# EAGLE schematic LAUNCHXL2_570LC43_RM57L (EAGLE 7.3.0), part 1 of 2
DATABASE: ./BOM/LAUNCHXL2_570LC43_RM57L_PARTDB.csv; DOC_NUMBER: LAUNCHXL2-570LC43 / LAUNCHXL2-RM57L; REV: A1

## Sheet 1 of 17
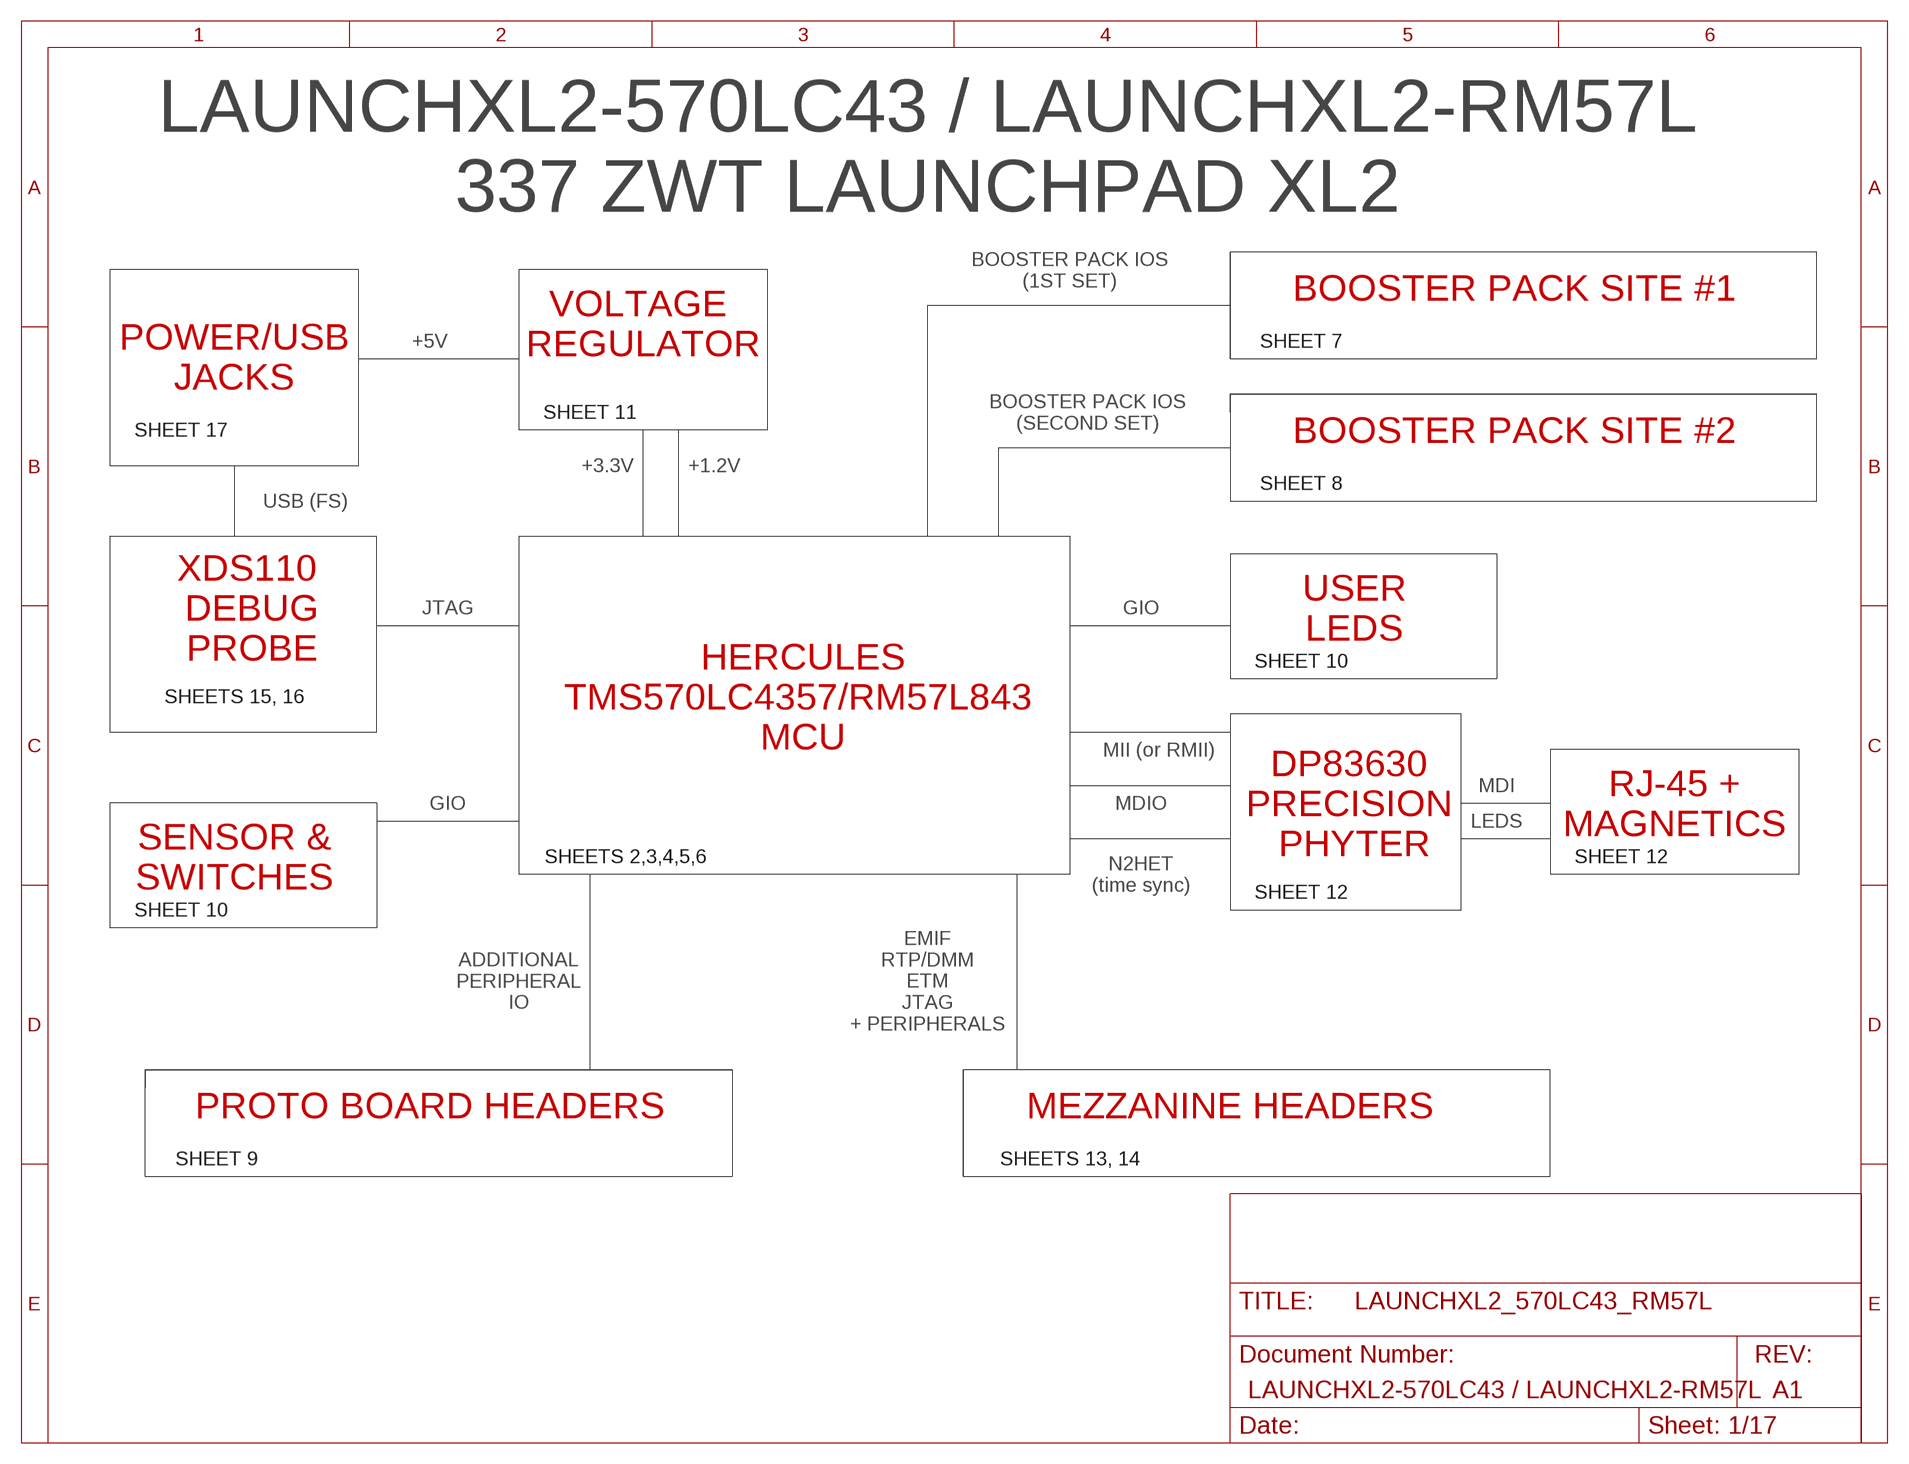
[diagram p0: schematic, sheet 1]

### Notes on the sheet
- LAUNCHXL2-570LC43 / LAUNCHXL2-RM57L
  337 ZWT LAUNCHPAD XL2
- BOOSTER PACK IOS
  (1ST SET)
- BOOSTER PACK SITE #1
- VOLTAGE 
  REGULATOR
- +5V | SHEET 7
- POWER/USB
  JACKS
- SHEET 11
- BOOSTER PACK IOS
  (SECOND SET)
- SHEET 17 | BOOSTER PACK SITE #2
- +3.3V | +1.2V
- SHEET 8
- USB (FS)
- XDS110 
  DEBUG
  PROBE
- JTAG | GIO
- USER
  LEDS
- SHEET 10
- SHEETS 15, 16
- HERCULES
  TMS570LC4357/RM57L843 
  MCU
- MII (or RMII)
- MDI
- GIO | MDIO
- DP83630 
  PRECISION 
  PHYTER
- RJ-45 +
  MAGNETICS
- LEDS
- SENSOR &
  SWITCHES
- SHEETS 2,3,4,5,6 | SHEET 12
- N2HET
  (time sync)
- SHEET 12
- SHEET 10
- ADDITIONAL
  PERIPHERAL
  IO
- EMIF
  RTP/DMM
  ETM
  JTAG
  + PERIPHERALS
- PROTO BOARD HEADERS | MEZZANINE HEADERS
- SHEET 9 | SHEETS 13, 14

## Sheet 2 of 17
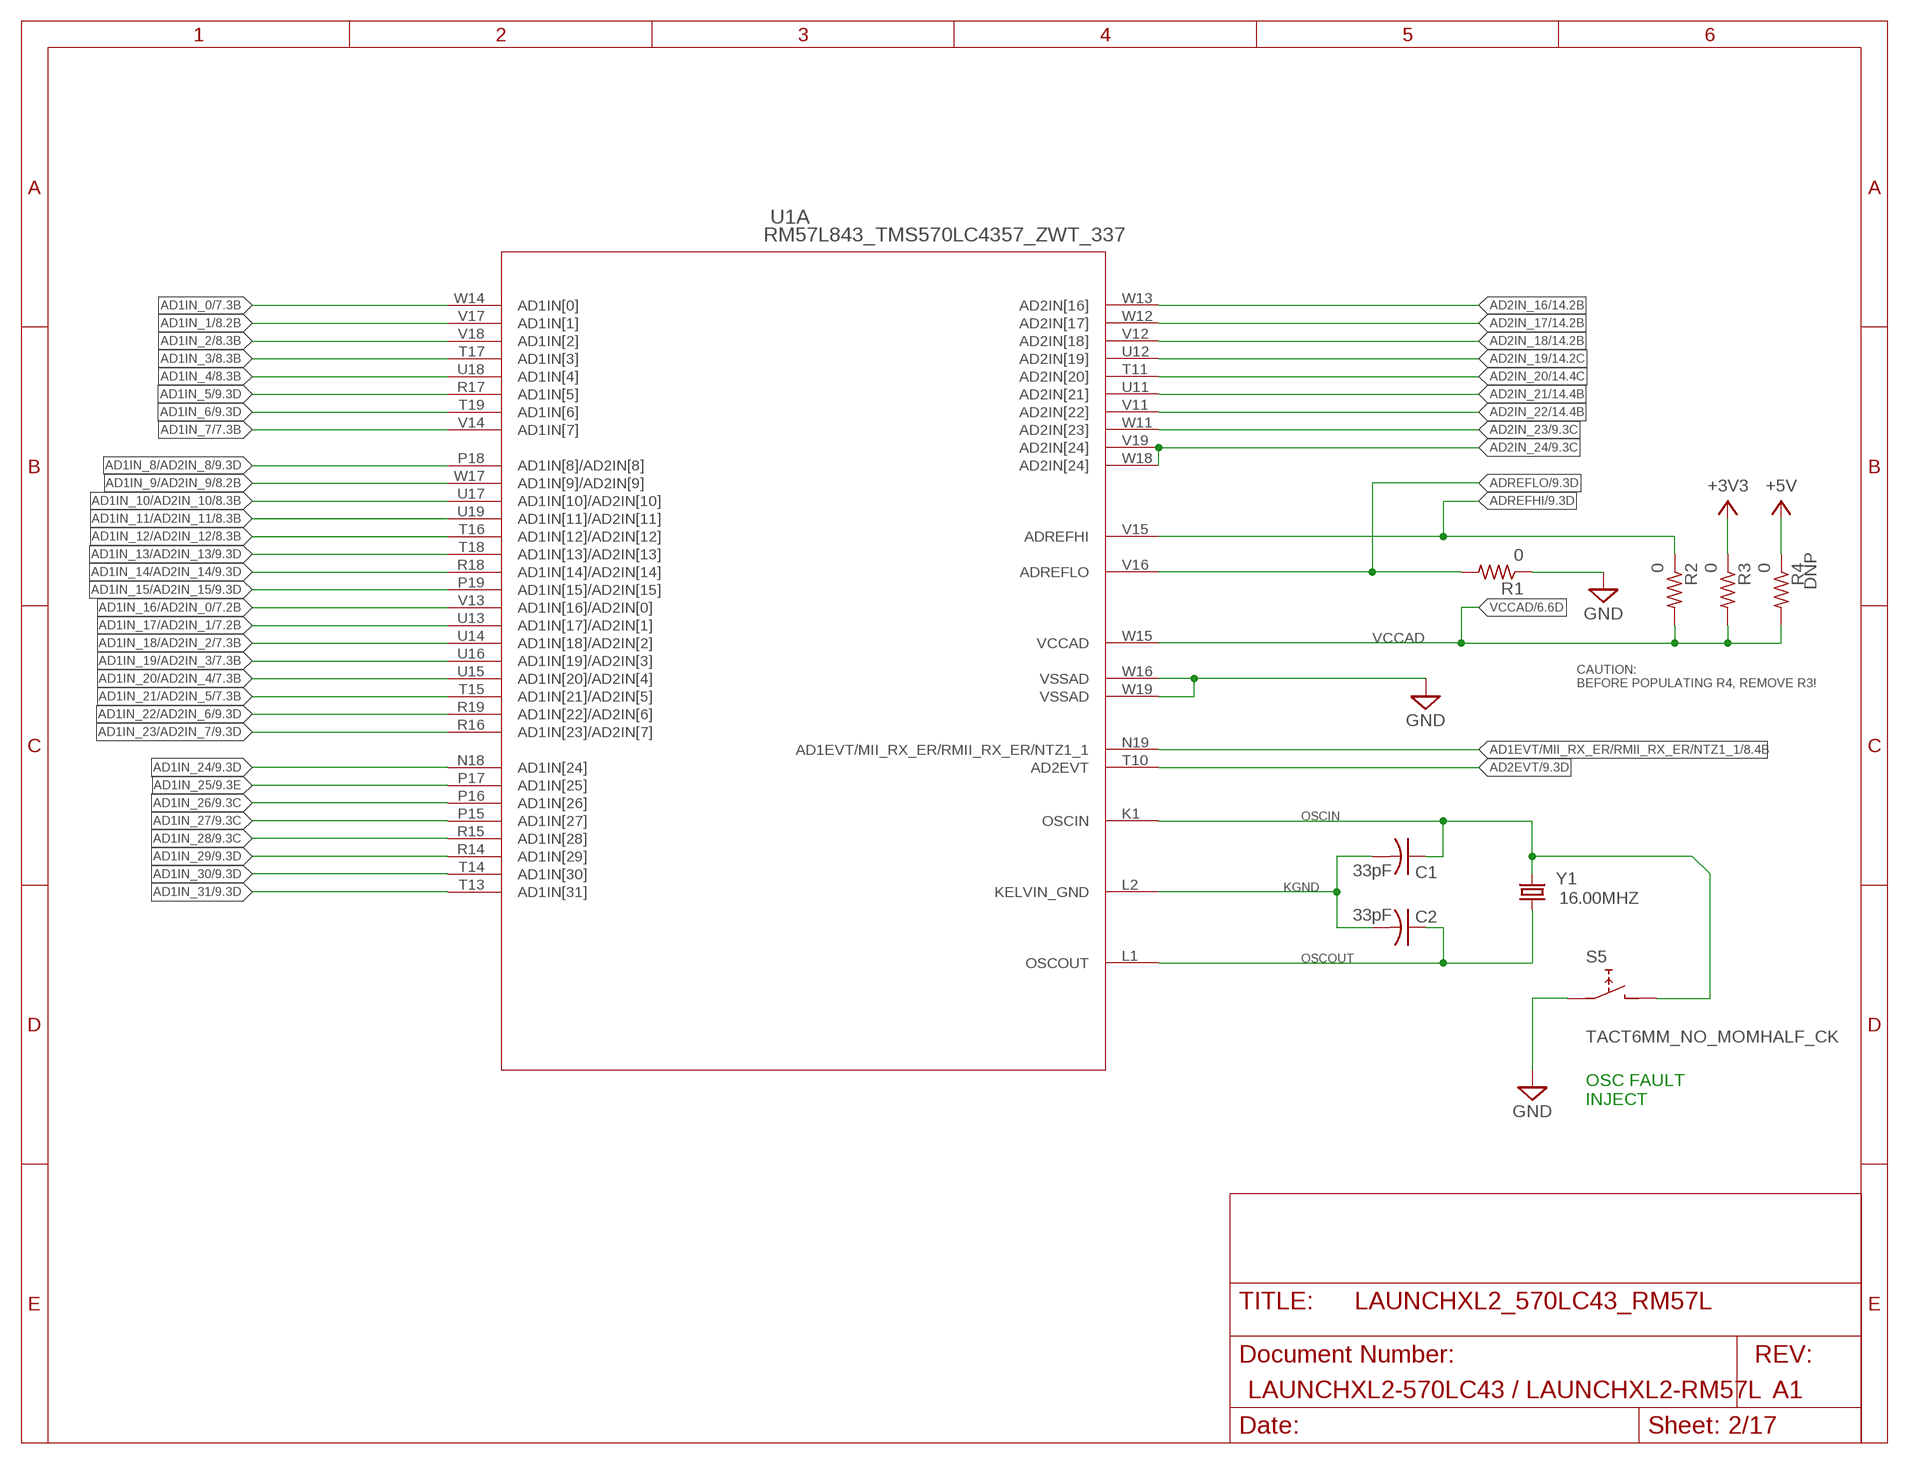
[diagram p1: schematic, sheet 2]

### Parts
C1  33pF  C-USC0201  [C0201]
C2  33pF  C-USC0201  [C0201]
R1  0  R-US_R0201  [R0201]
R2  0  R-US_R0201  [R0201]
R3  0  R-US_R0201  [R0201]
R4  0  R-US_R0201  [R0201]
S5  TACT6MM_NO_MOMHALF_CK  [CK_PTS645_SMD]
U1  RM57L843_TMS570LC4357_ZWT_337  [ZWT337]
Y1  16.00MHZ  CRYSTALCSM-3X  [CSM-3X]

### Nets
+3V3 [pwr]: R3.1 ; also sheet 3,5,6,7,8,9,10,11,12,13,14,15,16
+5V [pwr]: R4.1 ; also sheet 7,8,9,11,17
AD1EVT/MII_RX_ER/RMII_RX_ER/NTZ1_1: U1.N19(A:AD1EVT/MII_RX_ER/RMII_RX_ER/NTZ1_1) ; also sheet 8,14
AD1IN_0: U1.W14(A:AD1IN[0]) ; also sheet 7
AD1IN_1: U1.V17(A:AD1IN[1]) ; also sheet 8
AD1IN_2: U1.V18(A:AD1IN[2]) ; also sheet 8
AD1IN_3: U1.T17(A:AD1IN[3]) ; also sheet 8
AD1IN_4: U1.U18(A:AD1IN[4]) ; also sheet 8
AD1IN_5: U1.R17(A:AD1IN[5]) ; also sheet 9
AD1IN_6: U1.T19(A:AD1IN[6]) ; also sheet 9,10
AD1IN_7: U1.V14(A:AD1IN[7]) ; also sheet 7
AD1IN_8/AD2IN_8: U1.P18(A:AD1IN[8]/AD2IN[8]) ; also sheet 9
AD1IN_9/AD2IN_9: U1.W17(A:AD1IN[9]/AD2IN[9]) ; also sheet 8
AD1IN_10/AD2IN_10: U1.U17(A:AD1IN[10]/AD2IN[10]) ; also sheet 8
AD1IN_11/AD2IN_11: U1.U19(A:AD1IN[11]/AD2IN[11]) ; also sheet 8
AD1IN_12/AD2IN_12: U1.T16(A:AD1IN[12]/AD2IN[12]) ; also sheet 8
AD1IN_13/AD2IN_13: U1.T18(A:AD1IN[13]/AD2IN[13]) ; also sheet 9
AD1IN_14/AD2IN_14: U1.R18(A:AD1IN[14]/AD2IN[14]) ; also sheet 9
AD1IN_15/AD2IN_15: U1.P19(A:AD1IN[15]/AD2IN[15]) ; also sheet 9
AD1IN_16/AD2IN_0: U1.V13(A:AD1IN[16]/AD2IN[0]) ; also sheet 7
AD1IN_17/AD2IN_1: U1.U13(A:AD1IN[17]/AD2IN[1]) ; also sheet 7
AD1IN_18/AD2IN_2: U1.U14(A:AD1IN[18]/AD2IN[2]) ; also sheet 7
AD1IN_19/AD2IN_3: U1.U16(A:AD1IN[19]/AD2IN[3]) ; also sheet 7
AD1IN_20/AD2IN_4: U1.U15(A:AD1IN[20]/AD2IN[4]) ; also sheet 7
AD1IN_21/AD2IN_5: U1.T15(A:AD1IN[21]/AD2IN[5]) ; also sheet 7
AD1IN_22/AD2IN_6: U1.R19(A:AD1IN[22]/AD2IN[6]) ; also sheet 9
AD1IN_23/AD2IN_7: U1.R16(A:AD1IN[23]/AD2IN[7]) ; also sheet 9
AD1IN_24: U1.N18(A:AD1IN[24]) ; also sheet 9
AD1IN_25: U1.P17(A:AD1IN[25]) ; also sheet 9
AD1IN_26: U1.P16(A:AD1IN[26]) ; also sheet 9
AD1IN_27: U1.P15(A:AD1IN[27]) ; also sheet 9
AD1IN_28: U1.R15(A:AD1IN[28]) ; also sheet 9
AD1IN_29: U1.R14(A:AD1IN[29]) ; also sheet 9
AD1IN_30: U1.T14(A:AD1IN[30]) ; also sheet 9
AD1IN_31: U1.T13(A:AD1IN[31]) ; also sheet 9
AD2EVT: U1.T10(A:AD2EVT) ; also sheet 9
AD2IN_16: U1.W13(A:AD2IN[16]) ; also sheet 14
AD2IN_17: U1.W12(A:AD2IN[17]) ; also sheet 14
AD2IN_18: U1.V12(A:AD2IN[18]) ; also sheet 14
AD2IN_19: U1.U12(A:AD2IN[19]) ; also sheet 14
AD2IN_20: U1.T11(A:AD2IN[20]) ; also sheet 14
AD2IN_21: U1.U11(A:AD2IN[21]) ; also sheet 14
AD2IN_22: U1.V11(A:AD2IN[22]) ; also sheet 14
AD2IN_23: U1.W11(A:AD2IN[23]) ; also sheet 9,14
AD2IN_24: U1.V19(A:AD2IN[24]) U1.W18(A:AD2IN[24]) ; also sheet 9
ADREFHI: R2.1 U1.V15(A:ADREFHI) ; also sheet 9
ADREFLO: R1.2 U1.V16(A:ADREFLO) ; also sheet 9
GND [pwr]: R1.1 S5.1 U1.W16(A:VSSAD) U1.W19(A:VSSAD) ; also sheet 3,5,6,7,8,9,10,11,12,13,14,15,16,17
KGND: C1.2 C2.2 U1.L2(A:KELVIN_GND)
OSCIN: C1.1 S5.3 U1.K1(A:OSCIN) Y1.2
OSCOUT: C2.1 U1.L1(A:OSCOUT) Y1.1
VCCAD: R2.2 R3.2 R4.2 U1.W15(A:VCCAD) ; also sheet 6

### Notes on the sheet
- CAUTION:
  BEFORE POPULATING R4, REMOVE R3!
- OSC FAULT
  INJECT

## Sheet 3 of 17
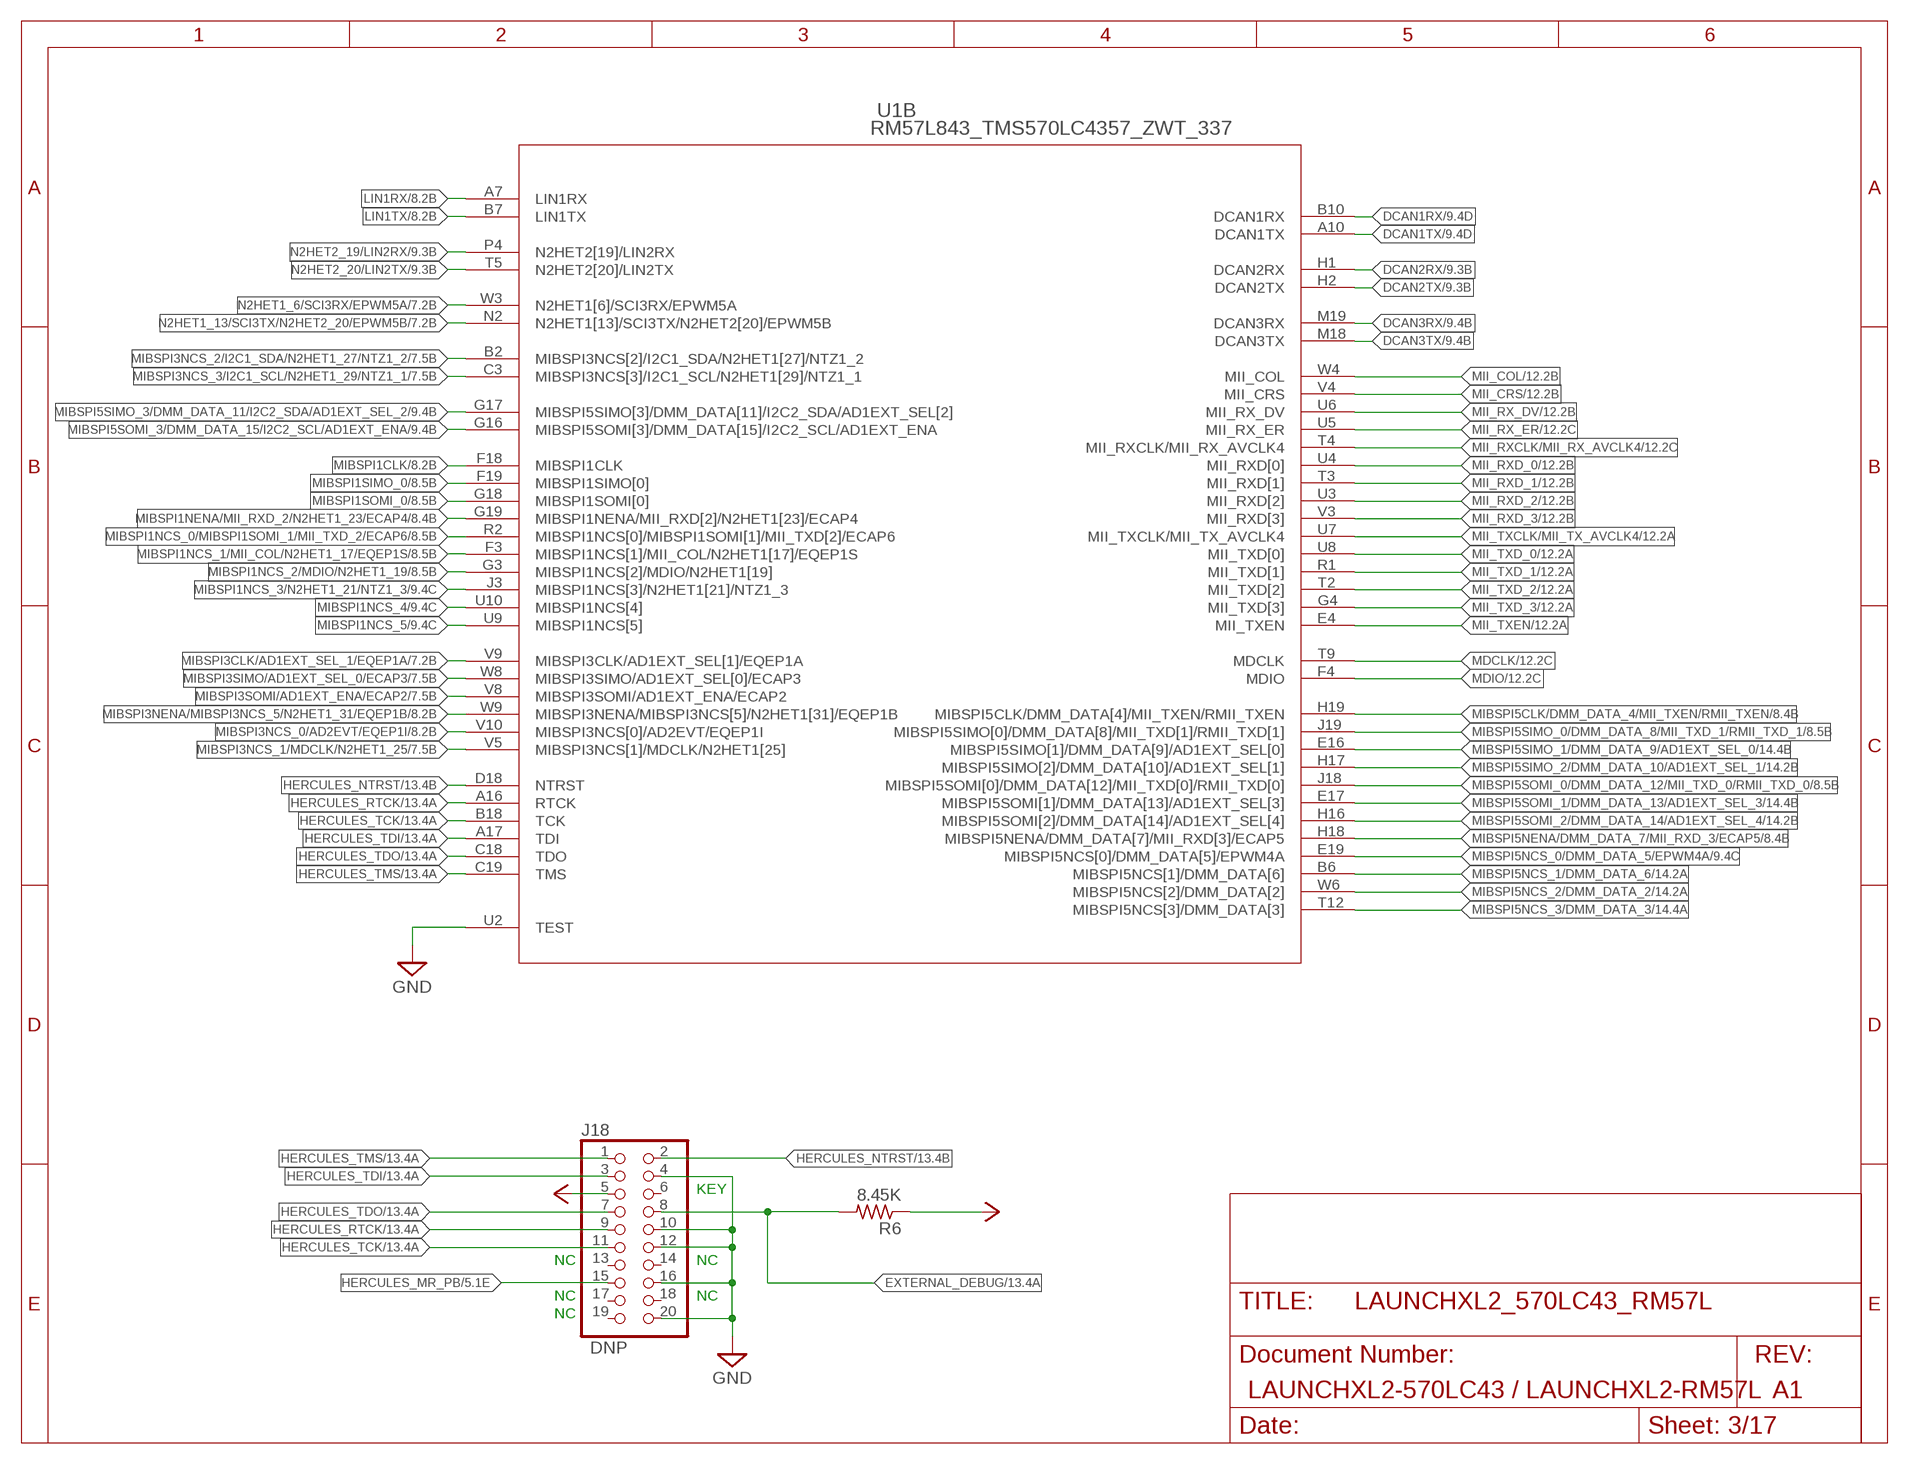
[diagram p2: schematic, sheet 3]

### Parts
J18  PINHD-2X10SAMTEC-FTR-110-51-S-D-06  [SAMTEC-FTR-110-51-S-D-06]
R6  8.45K  R-US_R0201  [R0201]

### Nets
+3V3 [pwr]: J18.5 R6.1 ; also sheet 2,5,6,7,8,9,10,11,12,13,14,15,16
DCAN1RX: U1.B10(B:DCAN1RX) ; also sheet 9
DCAN1TX: U1.A10(B:DCAN1TX) ; also sheet 9
DCAN2RX: U1.H1(B:DCAN2RX) ; also sheet 9
DCAN2TX: U1.H2(B:DCAN2TX) ; also sheet 9
DCAN3RX: U1.M19(B:DCAN3RX) ; also sheet 9
DCAN3TX: U1.M18(B:DCAN3TX) ; also sheet 9
EXTERNAL_DEBUG: J18.8 R6.2 ; also sheet 13,15
GND [pwr]: J18.4 J18.10 J18.12 J18.16 J18.20 U1.U2(B:TEST) ; also sheet 2,5,6,7,8,9,10,11,12,13,14,15,16,17
HERCULES_MR_PB: J18.15 ; also sheet 5,13,15
HERCULES_NTRST: J18.2 U1.D18(B:NTRST) ; also sheet 13,15
HERCULES_RTCK [ETM]: J18.9 U1.A16(B:RTCK) ; also sheet 13,15
HERCULES_TCK [ETM]: J18.11 U1.B18(B:TCK) ; also sheet 13,15
HERCULES_TDI: J18.3 U1.A17(B:TDI) ; also sheet 13,15
HERCULES_TDO: J18.7 U1.C18(B:TDO) ; also sheet 13,15
HERCULES_TMS: J18.1 U1.C19(B:TMS) ; also sheet 13,15
LIN1RX: U1.A7(B:LIN1RX) ; also sheet 8,15
LIN1TX: U1.B7(B:LIN1TX) ; also sheet 8,15
MDCLK: U1.T9(B:MDCLK) ; also sheet 12
MDIO: U1.F4(B:MDIO) ; also sheet 12
MIBSPI1CLK: U1.F18(B:MIBSPI1CLK) ; also sheet 8,13,14
MIBSPI1NCS_0/MIBSPI1SOMI_1/MII_TXD_2/ECAP6: U1.R2(B:MIBSPI1NCS[0]/MIBSPI1SOMI[1]/MII_TXD[2]/ECAP6) ; also sheet 8,14
MIBSPI1NCS_1/MII_COL/N2HET1_17/EQEP1S: U1.F3(B:MIBSPI1NCS[1]/MII_COL/N2HET1[17]/EQEP1S) ; also sheet 8,14
MIBSPI1NCS_2/MDIO/N2HET1_19: U1.G3(B:MIBSPI1NCS[2]/MDIO/N2HET1[19]) ; also sheet 8,14
MIBSPI1NCS_3/N2HET1_21/NTZ1_3: U1.J3(B:MIBSPI1NCS[3]/N2HET1[21]/NTZ1_3) ; also sheet 9
MIBSPI1NCS_4: U1.U10(B:MIBSPI1NCS[4]) ; also sheet 9
MIBSPI1NCS_5: U1.U9(B:MIBSPI1NCS[5]) ; also sheet 9
MIBSPI1NENA/MII_RXD_2/N2HET1_23/ECAP4: U1.G19(B:MIBSPI1NENA/MII_RXD[2]/N2HET1[23]/ECAP4) ; also sheet 8,14
MIBSPI1SIMO_0: U1.F19(B:MIBSPI1SIMO[0]) ; also sheet 8,14
MIBSPI1SOMI_0: U1.G18(B:MIBSPI1SOMI[0]) ; also sheet 8,14
MIBSPI3CLK/AD1EXT_SEL_1/EQEP1A: U1.V9(B:MIBSPI3CLK/AD1EXT_SEL[1]/EQEP1A) ; also sheet 7
MIBSPI3NCS_0/AD2EVT/EQEP1I: U1.V10(B:MIBSPI3NCS[0]/AD2EVT/EQEP1I) ; also sheet 8,14
MIBSPI3NCS_1/MDCLK/N2HET1_25: U1.V5(B:MIBSPI3NCS[1]/MDCLK/N2HET1[25]) ; also sheet 7,14
MIBSPI3NCS_2/I2C1_SDA/N2HET1_27/NTZ1_2: U1.B2(B:MIBSPI3NCS[2]/I2C1_SDA/N2HET1[27]/NTZ1_2) ; also sheet 7,14
MIBSPI3NCS_3/I2C1_SCL/N2HET1_29/NTZ1_1: U1.C3(B:MIBSPI3NCS[3]/I2C1_SCL/N2HET1[29]/NTZ1_1) ; also sheet 7,14
MIBSPI3NENA/MIBSPI3NCS_5/N2HET1_31/EQEP1B: U1.W9(B:MIBSPI3NENA/MIBSPI3NCS[5]/N2HET1[31]/EQEP1B) ; also sheet 8
MIBSPI3SIMO/AD1EXT_SEL_0/ECAP3: U1.W8(B:MIBSPI3SIMO/AD1EXT_SEL[0]/ECAP3) ; also sheet 7
MIBSPI3SOMI/AD1EXT_ENA/ECAP2: U1.V8(B:MIBSPI3SOMI/AD1EXT_ENA/ECAP2) ; also sheet 7
MIBSPI5CLK/DMM_DATA_4/MII_TXEN/RMII_TXEN: U1.H19(B:MIBSPI5CLK/DMM_DATA[4]/MII_TXEN/RMII_TXEN) ; also sheet 8,14
MIBSPI5NCS_0/DMM_DATA_5/EPWM4A: U1.E19(B:MIBSPI5NCS[0]/DMM_DATA[5]/EPWM4A) ; also sheet 9,14
MIBSPI5NCS_1/DMM_DATA_6: U1.B6(B:MIBSPI5NCS[1]/DMM_DATA[6]) ; also sheet 14
MIBSPI5NCS_2/DMM_DATA_2: U1.W6(B:MIBSPI5NCS[2]/DMM_DATA[2]) ; also sheet 14
MIBSPI5NCS_3/DMM_DATA_3: U1.T12(B:MIBSPI5NCS[3]/DMM_DATA[3]) ; also sheet 14
MIBSPI5NENA/DMM_DATA_7/MII_RXD_3/ECAP5: U1.H18(B:MIBSPI5NENA/DMM_DATA[7]/MII_RXD[3]/ECAP5) ; also sheet 8,14
MIBSPI5SIMO_0/DMM_DATA_8/MII_TXD_1/RMII_TXD_1: U1.J19(B:MIBSPI5SIMO[0]/DMM_DATA[8]/MII_TXD[1]/RMII_TXD[1]) ; also sheet 8,14
MIBSPI5SIMO_1/DMM_DATA_9/AD1EXT_SEL_0: U1.E16(B:MIBSPI5SIMO[1]/DMM_DATA[9]/AD1EXT_SEL[0]) ; also sheet 14
MIBSPI5SIMO_2/DMM_DATA_10/AD1EXT_SEL_1: U1.H17(B:MIBSPI5SIMO[2]/DMM_DATA[10]/AD1EXT_SEL[1]) ; also sheet 14
MIBSPI5SIMO_3/DMM_DATA_11/I2C2_SDA/AD1EXT_SEL_2: U1.G17(B:MIBSPI5SIMO[3]/DMM_DATA[11]/I2C2_SDA/AD1EXT_SEL[2]) ; also sheet 9,14
MIBSPI5SOMI_0/DMM_DATA_12/MII_TXD_0/RMII_TXD_0: U1.J18(B:MIBSPI5SOMI[0]/DMM_DATA[12]/MII_TXD[0]/RMII_TXD[0]) ; also sheet 8,14
MIBSPI5SOMI_1/DMM_DATA_13/AD1EXT_SEL_3: U1.E17(B:MIBSPI5SOMI[1]/DMM_DATA[13]/AD1EXT_SEL[3]) ; also sheet 14
MIBSPI5SOMI_2/DMM_DATA_14/AD1EXT_SEL_4: U1.H16(B:MIBSPI5SOMI[2]/DMM_DATA[14]/AD1EXT_SEL[4]) ; also sheet 14
MIBSPI5SOMI_3/DMM_DATA_15/I2C2_SCL/AD1EXT_ENA: U1.G16(B:MIBSPI5SOMI[3]/DMM_DATA[15]/I2C2_SCL/AD1EXT_ENA) ; also sheet 9,14
MII_COL [ETHER]: U1.W4(B:MII_COL) ; also sheet 12
MII_CRS [ETHER]: U1.V4(B:MII_CRS) ; also sheet 12
MII_RX_DV [ETHER]: U1.U6(B:MII_RX_DV) ; also sheet 12
MII_RX_ER [ETHER]: U1.U5(B:MII_RX_ER) ; also sheet 12
MII_RXCLK/MII_RX_AVCLK4 [ETHER]: U1.T4(B:MII_RXCLK/MII_RX_AVCLK4) ; also sheet 12
MII_RXD_0 [ETHER]: U1.U4(B:MII_RXD[0]) ; also sheet 12
MII_RXD_1 [ETHER]: U1.T3(B:MII_RXD[1]) ; also sheet 12
MII_RXD_2 [ETHER]: U1.U3(B:MII_RXD[2]) ; also sheet 12
MII_RXD_3 [ETHER]: U1.V3(B:MII_RXD[3]) ; also sheet 12
MII_TXCLK/MII_TX_AVCLK4 [ETHER]: U1.U7(B:MII_TXCLK/MII_TX_AVCLK4) ; also sheet 12
MII_TXD_0 [ETHER]: U1.U8(B:MII_TXD[0]) ; also sheet 12
MII_TXD_1 [ETHER]: U1.R1(B:MII_TXD[1]) ; also sheet 12
MII_TXD_2 [ETHER]: U1.T2(B:MII_TXD[2]) ; also sheet 12
MII_TXD_3 [ETHER]: U1.G4(B:MII_TXD[3]) ; also sheet 12
MII_TXEN [ETHER]: U1.E4(B:MII_TXEN) ; also sheet 12
N2HET1_6/SCI3RX/EPWM5A: U1.W3(B:N2HET1[6]/SCI3RX/EPWM5A) ; also sheet 7
N2HET1_13/SCI3TX/N2HET2_20/EPWM5B: U1.N2(B:N2HET1[13]/SCI3TX/N2HET2[20]/EPWM5B) ; also sheet 7
N2HET2_19/LIN2RX: U1.P4(B:N2HET2[19]/LIN2RX) ; also sheet 9,14
N2HET2_20/LIN2TX: U1.T5(B:N2HET2[20]/LIN2TX) ; also sheet 9,14
Unconnected: J18.6 J18.13 J18.14 J18.17 J18.18 J18.19

### Notes on the sheet
- KEY
- NC | NC
- NC | NC
- NC

## Sheet 4 of 17
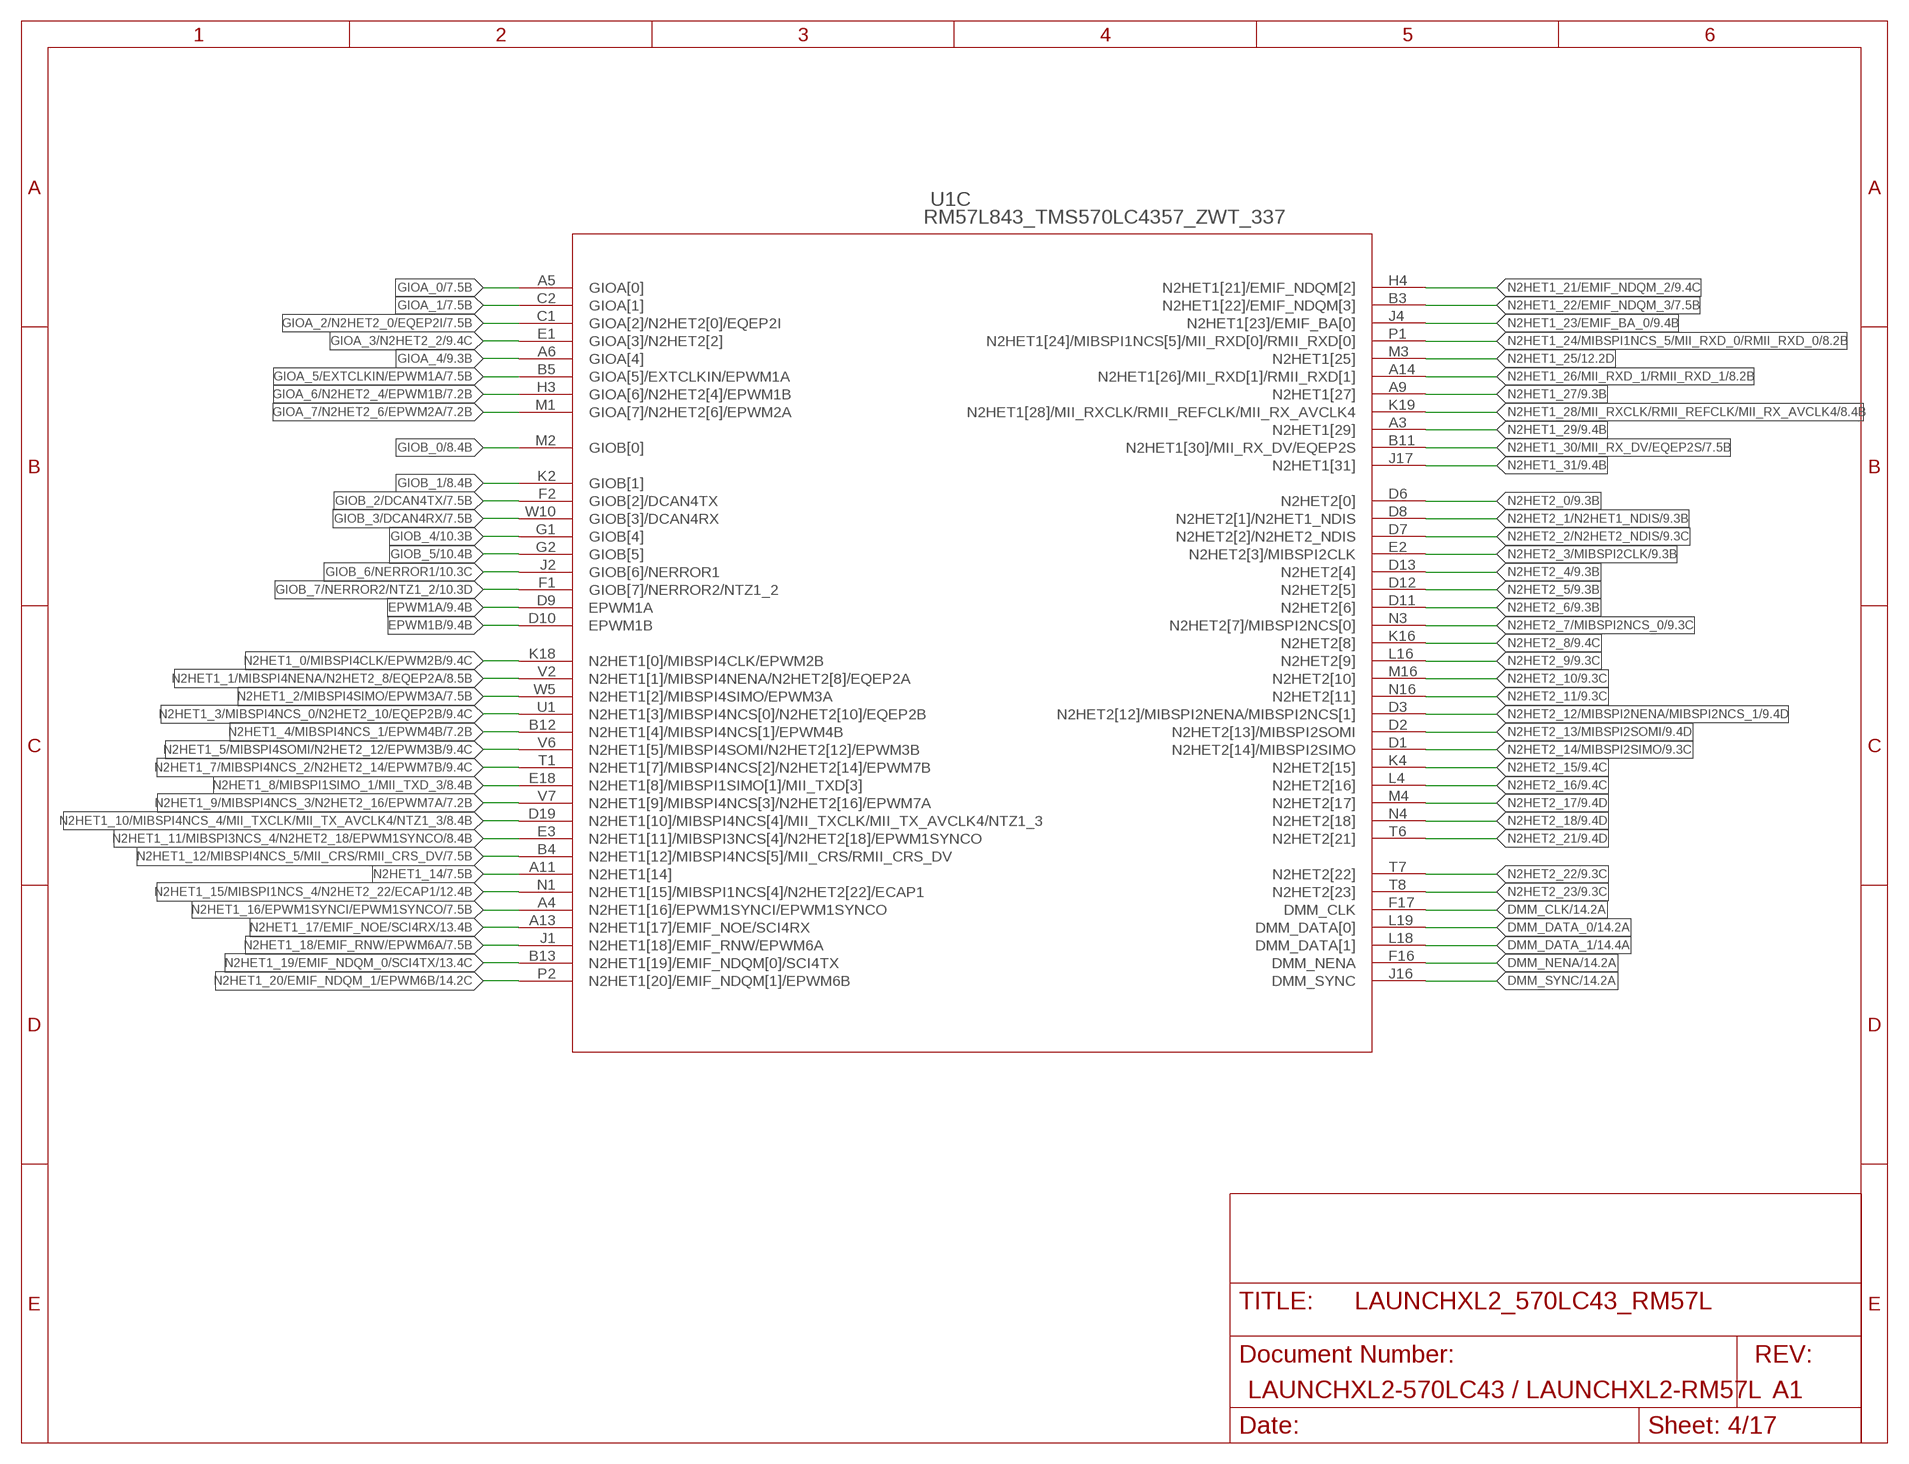
[diagram p3: schematic, sheet 4]

### Nets
DMM_CLK: U1.F17(C:DMM_CLK) ; also sheet 14
DMM_DATA_0: U1.L19(C:DMM_DATA[0]) ; also sheet 14
DMM_DATA_1: U1.L18(C:DMM_DATA[1]) ; also sheet 14
DMM_NENA: U1.F16(C:DMM_NENA) ; also sheet 14
DMM_SYNC: U1.J16(C:DMM_SYNC) ; also sheet 14
EPWM1A: U1.D9(C:EPWM1A) ; also sheet 9,14
EPWM1B: U1.D10(C:EPWM1B) ; also sheet 9,14
GIOA_0: U1.A5(C:GIOA[0]) ; also sheet 7,9
GIOA_1: U1.C2(C:GIOA[1]) ; also sheet 7
GIOA_2/N2HET2_0/EQEP2I: U1.C1(C:GIOA[2]/N2HET2[0]/EQEP2I) ; also sheet 7
GIOA_3/N2HET2_2: U1.E1(C:GIOA[3]/N2HET2[2]) ; also sheet 9,12
GIOA_4: U1.A6(C:GIOA[4]) ; also sheet 9,12
GIOA_5/EXTCLKIN/EPWM1A: U1.B5(C:GIOA[5]/EXTCLKIN/EPWM1A) ; also sheet 7
GIOA_6/N2HET2_4/EPWM1B: U1.H3(C:GIOA[6]/N2HET2[4]/EPWM1B) ; also sheet 7
GIOA_7/N2HET2_6/EPWM2A: U1.M1(C:GIOA[7]/N2HET2[6]/EPWM2A) ; also sheet 7
GIOB_0: U1.M2(C:GIOB[0]) ; also sheet 8
GIOB_1: U1.K2(C:GIOB[1]) ; also sheet 8
GIOB_2/DCAN4TX: U1.F2(C:GIOB[2]/DCAN4TX) ; also sheet 7,9,14
GIOB_3/DCAN4RX: U1.W10(C:GIOB[3]/DCAN4RX) ; also sheet 7,9,14
GIOB_4: U1.G1(C:GIOB[4]) ; also sheet 10
GIOB_5: U1.G2(C:GIOB[5]) ; also sheet 10
GIOB_6/NERROR1: U1.J2(C:GIOB[6]/NERROR1) ; also sheet 10
GIOB_7/NERROR2/NTZ1_2: U1.F1(C:GIOB[7]/NERROR2/NTZ1_2) ; also sheet 10
N2HET1_0/MIBSPI4CLK/EPWM2B: U1.K18(C:N2HET1[0]/MIBSPI4CLK/EPWM2B) ; also sheet 9
N2HET1_1/MIBSPI4NENA/N2HET2_8/EQEP2A: U1.V2(C:N2HET1[1]/MIBSPI4NENA/N2HET2[8]/EQEP2A) ; also sheet 8,9,14
N2HET1_2/MIBSPI4SIMO/EPWM3A: U1.W5(C:N2HET1[2]/MIBSPI4SIMO/EPWM3A) ; also sheet 7
N2HET1_3/MIBSPI4NCS_0/N2HET2_10/EQEP2B: U1.U1(C:N2HET1[3]/MIBSPI4NCS[0]/N2HET2[10]/EQEP2B) ; also sheet 9,14
N2HET1_4/MIBSPI4NCS_1/EPWM4B: U1.B12(C:N2HET1[4]/MIBSPI4NCS[1]/EPWM4B) ; also sheet 7
N2HET1_5/MIBSPI4SOMI/N2HET2_12/EPWM3B: U1.V6(C:N2HET1[5]/MIBSPI4SOMI/N2HET2[12]/EPWM3B) ; also sheet 9
N2HET1_7/MIBSPI4NCS_2/N2HET2_14/EPWM7B: U1.T1(C:N2HET1[7]/MIBSPI4NCS[2]/N2HET2[14]/EPWM7B) ; also sheet 9
N2HET1_8/MIBSPI1SIMO_1/MII_TXD_3: U1.E18(C:N2HET1[8]/MIBSPI1SIMO[1]/MII_TXD[3]) ; also sheet 8,13
N2HET1_9/MIBSPI4NCS_3/N2HET2_16/EPWM7A: U1.V7(C:N2HET1[9]/MIBSPI4NCS[3]/N2HET2[16]/EPWM7A) ; also sheet 7
N2HET1_10/MIBSPI4NCS_4/MII_TXCLK/MII_TX_AVCLK4/NTZ1_3: U1.D19(C:N2HET1[10]/MIBSPI4NCS[4]/MII_TXCLK/MII_TX_AVCLK4/NTZ1_3) ; also sheet 8,13
N2HET1_11/MIBSPI3NCS_4/N2HET2_18/EPWM1SYNCO: U1.E3(C:N2HET1[11]/MIBSPI3NCS[4]/N2HET2[18]/EPWM1SYNCO) ; also sheet 8
N2HET1_12/MIBSPI4NCS_5/MII_CRS/RMII_CRS_DV: U1.B4(C:N2HET1[12]/MIBSPI4NCS[5]/MII_CRS/RMII_CRS_DV) ; also sheet 7,14
N2HET1_14: U1.A11(C:N2HET1[14]) ; also sheet 7
N2HET1_15/MIBSPI1NCS_4/N2HET2_22/ECAP1: U1.N1(C:N2HET1[15]/MIBSPI1NCS[4]/N2HET2[22]/ECAP1) ; also sheet 12
N2HET1_16/EPWM1SYNCI/EPWM1SYNCO: U1.A4(C:N2HET1[16]/EPWM1SYNCI/EPWM1SYNCO) ; also sheet 7
N2HET1_17/EMIF_NOE/SCI4RX: U1.A13(C:N2HET1[17]/EMIF_NOE/SCI4RX) ; also sheet 13
N2HET1_18/EMIF_RNW/EPWM6A: U1.J1(C:N2HET1[18]/EMIF_RNW/EPWM6A) ; also sheet 7
N2HET1_19/EMIF_NDQM_0/SCI4TX: U1.B13(C:N2HET1[19]/EMIF_NDQM[0]/SCI4TX) ; also sheet 13
N2HET1_20/EMIF_NDQM_1/EPWM6B: U1.P2(C:N2HET1[20]/EMIF_NDQM[1]/EPWM6B) ; also sheet 14
N2HET1_21/EMIF_NDQM_2: U1.H4(C:N2HET1[21]/EMIF_NDQM[2]) ; also sheet 9,12
N2HET1_22/EMIF_NDQM_3: U1.B3(C:N2HET1[22]/EMIF_NDQM[3]) ; also sheet 7
N2HET1_23/EMIF_BA_0: U1.J4(C:N2HET1[23]/EMIF_BA[0]) ; also sheet 9
N2HET1_24/MIBSPI1NCS_5/MII_RXD_0/RMII_RXD_0: U1.P1(C:N2HET1[24]/MIBSPI1NCS[5]/MII_RXD[0]/RMII_RXD[0]) ; also sheet 8,14
N2HET1_25: U1.M3(C:N2HET1[25]) ; also sheet 12
N2HET1_26/MII_RXD_1/RMII_RXD_1: U1.A14(C:N2HET1[26]/MII_RXD[1]/RMII_RXD[1]) ; also sheet 8,14
N2HET1_27: U1.A9(C:N2HET1[27]) ; also sheet 9
N2HET1_28/MII_RXCLK/RMII_REFCLK/MII_RX_AVCLK4: U1.K19(C:N2HET1[28]/MII_RXCLK/RMII_REFCLK/MII_RX_AVCLK4) ; also sheet 8,14
N2HET1_29: U1.A3(C:N2HET1[29]) ; also sheet 9
N2HET1_30/MII_RX_DV/EQEP2S: U1.B11(C:N2HET1[30]/MII_RX_DV/EQEP2S) ; also sheet 7,14
N2HET1_31: U1.J17(C:N2HET1[31]) ; also sheet 9,12
N2HET2_0: U1.D6(C:N2HET2[0]) ; also sheet 9
N2HET2_1/N2HET1_NDIS: U1.D8(C:N2HET2[1]/N2HET1_NDIS) ; also sheet 9
N2HET2_2/N2HET2_NDIS: U1.D7(C:N2HET2[2]/N2HET2_NDIS) ; also sheet 9
N2HET2_3/MIBSPI2CLK: U1.E2(C:N2HET2[3]/MIBSPI2CLK) ; also sheet 9
N2HET2_4: U1.D13(C:N2HET2[4]) ; also sheet 9,12
N2HET2_5: U1.D12(C:N2HET2[5]) ; also sheet 9,12
N2HET2_6: U1.D11(C:N2HET2[6]) ; also sheet 9,12
N2HET2_7/MIBSPI2NCS_0: U1.N3(C:N2HET2[7]/MIBSPI2NCS[0]) ; also sheet 9
N2HET2_8: U1.K16(C:N2HET2[8]) ; also sheet 9
N2HET2_9: U1.L16(C:N2HET2[9]) ; also sheet 9
N2HET2_10: U1.M16(C:N2HET2[10]) ; also sheet 9
N2HET2_11: U1.N16(C:N2HET2[11]) ; also sheet 9
N2HET2_12/MIBSPI2NENA/MIBSPI2NCS_1: U1.D3(C:N2HET2[12]/MIBSPI2NENA/MIBSPI2NCS[1]) ; also sheet 9
N2HET2_13/MIBSPI2SOMI: U1.D2(C:N2HET2[13]/MIBSPI2SOMI) ; also sheet 9
N2HET2_14/MIBSPI2SIMO: U1.D1(C:N2HET2[14]/MIBSPI2SIMO) ; also sheet 9
N2HET2_15: U1.K4(C:N2HET2[15]) ; also sheet 9
N2HET2_16: U1.L4(C:N2HET2[16]) ; also sheet 9
N2HET2_17: U1.M4(C:N2HET2[17]) ; also sheet 9
N2HET2_18: U1.N4(C:N2HET2[18]) ; also sheet 9
N2HET2_21: U1.T6(C:N2HET2[21]) ; also sheet 9
N2HET2_22: U1.T7(C:N2HET2[22]) ; also sheet 9,12
N2HET2_23: U1.T8(C:N2HET2[23]) ; also sheet 9,12

## Sheet 5 of 17
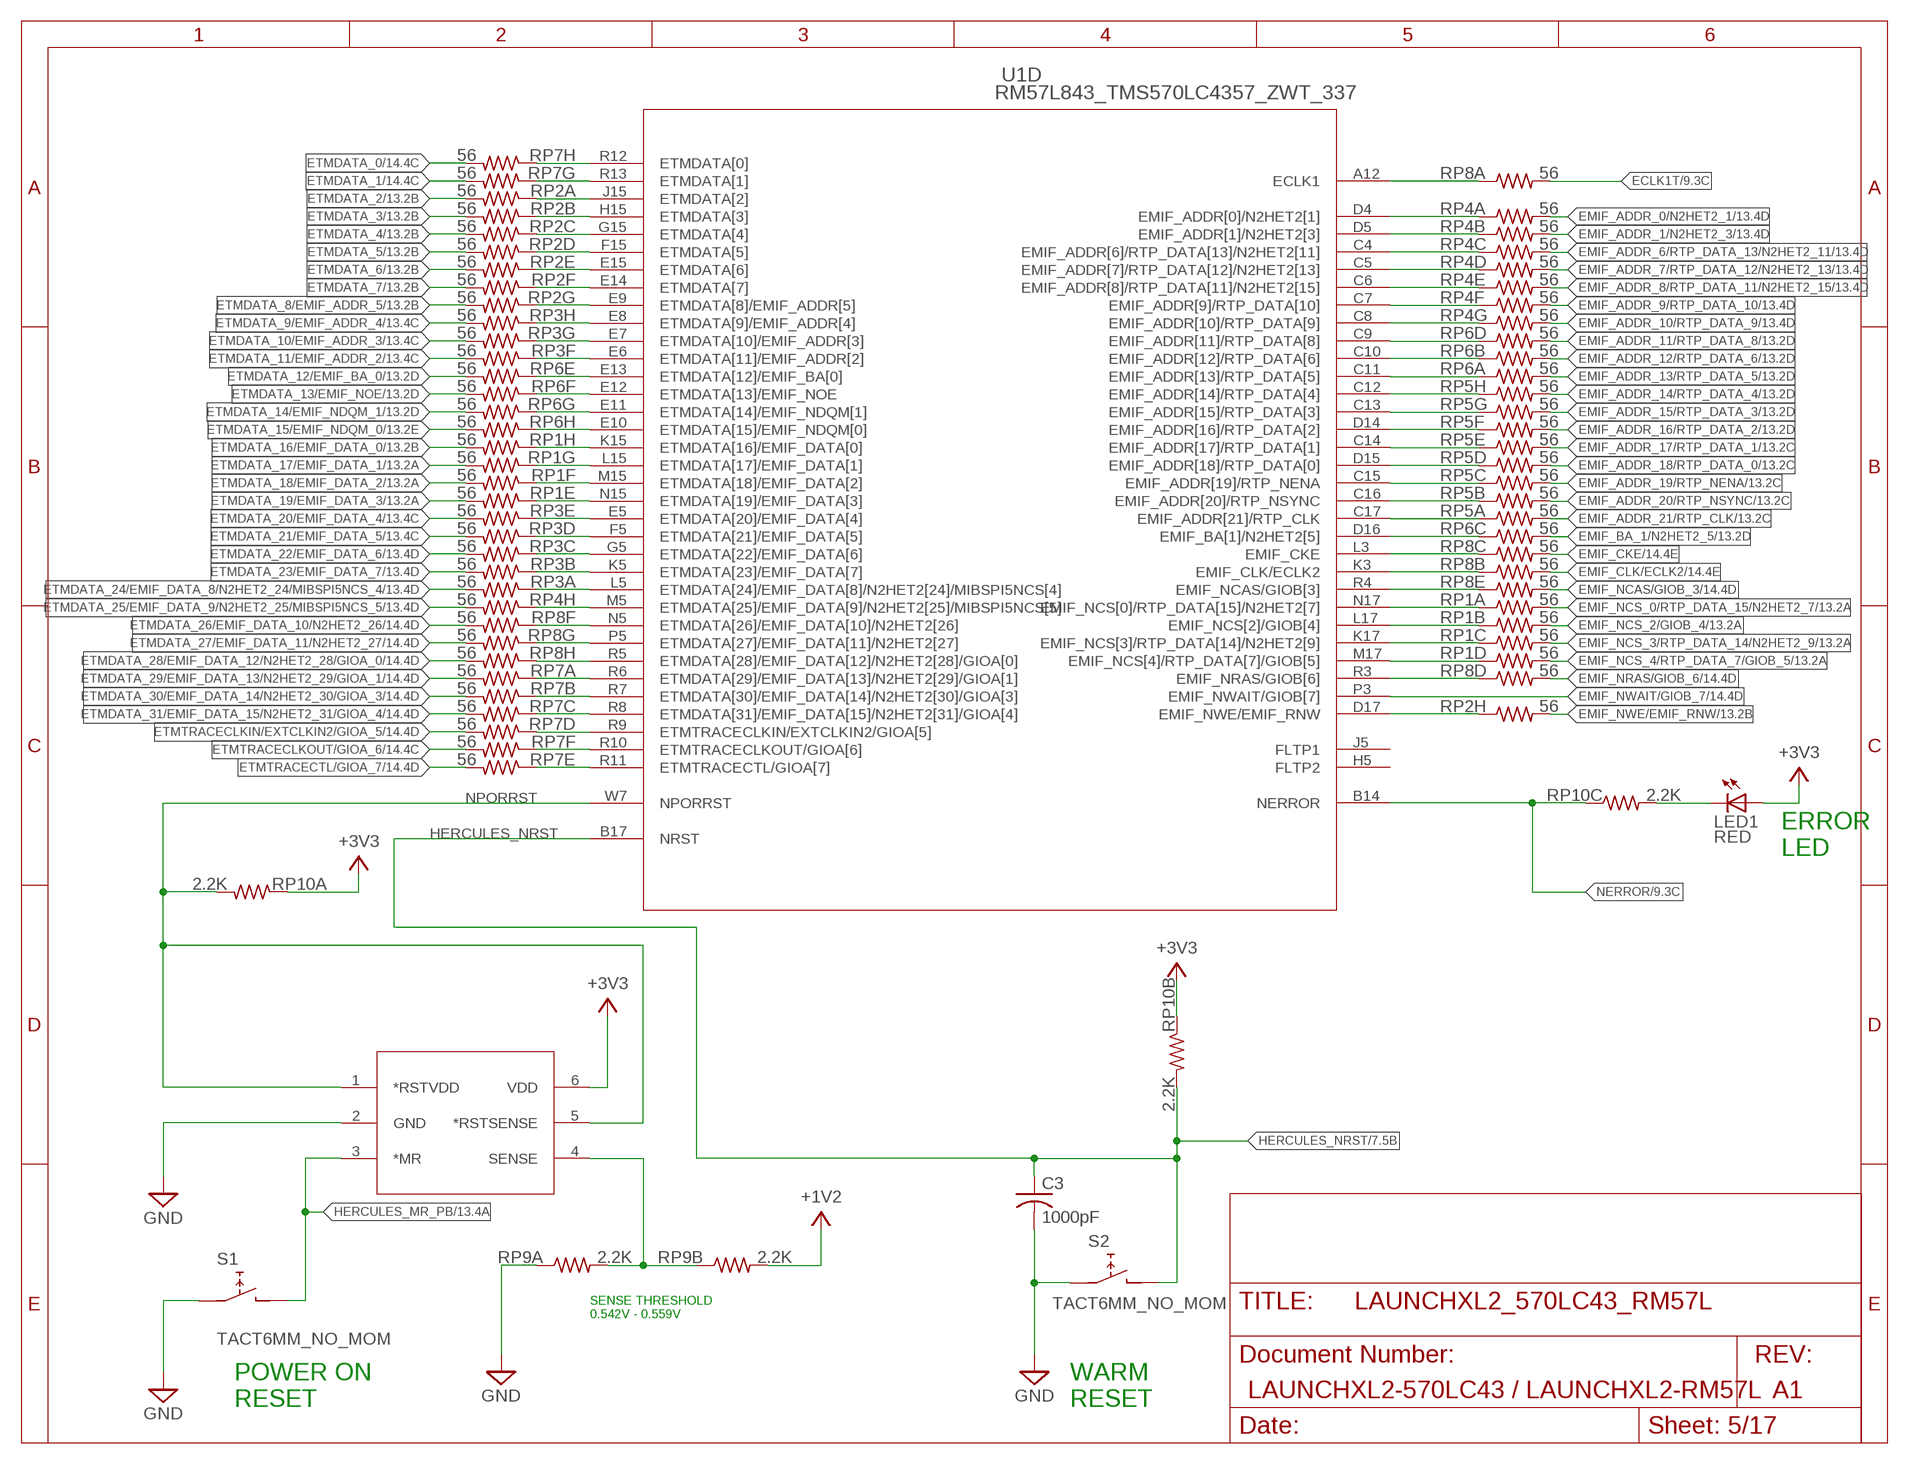
[diagram p4: schematic, sheet 5]

### Parts
C3  1000pF  C-USC0201  [C0201]
LED1  RED  LEDCHIPLED_0603  [CHIPLED_0603]
RP1  56  R-ARRAY-8_  [RP8_1506_1606]
RP2  56  R-ARRAY-8_  [RP8_1506_1606]
RP3  56  R-ARRAY-8_  [RP8_1506_1606]
RP4  56  R-ARRAY-8_  [RP8_1506_1606]
RP5  56  R-ARRAY-8_  [RP8_1506_1606]
RP6  56  R-ARRAY-8_  [RP8_1506_1606]
RP7  56  R-ARRAY-8_  [RP8_1506_1606]
RP8  56  R-ARRAY-8_  [RP8_1506_1606]
RP9  2.2K  R-ARRAY-8_  [RP8_1506_1606]
RP10  2.2K  R-ARRAY-8_  [RP8_1506_1606]
S1  TACT6MM_NO_MOM  [CK_PTS645_SMD]
S2  TACT6MM_NO_MOM  [CK_PTS645_SMD]
U2  TPS3106K33_DBV_6  [DBV6]

### Nets
+1V2 [pwr]: RP9.4 ; also sheet 6,11,15
+3V3 [pwr]: LED1.A RP10.1 RP10.3 U2.6(VDD) ; also sheet 2,3,6,7,8,9,10,11,12,13,14,15,16
ECLK1 [ETHER]: RP8.1 U1.A12(D:ECLK1)
ECLK1T [ETHER]: RP8.2 ; also sheet 9,12
EMA0 [EMIF]: RP4.1 U1.D4(D:EMIF_ADDR[0]/N2HET2[1])
EMA1 [EMIF]: RP4.3 U1.D5(D:EMIF_ADDR[1]/N2HET2[3])
EMA6 [EMIF]: RP4.5 U1.C4(D:EMIF_ADDR[6]/RTP_DATA[13]/N2HET2[11])
EMA7 [EMIF]: RP4.7 U1.C5(D:EMIF_ADDR[7]/RTP_DATA[12]/N2HET2[13])
EMA8 [EMIF]: RP4.9 U1.C6(D:EMIF_ADDR[8]/RTP_DATA[11]/N2HET2[15])
EMA9 [EMIF]: RP4.11 U1.C7(D:EMIF_ADDR[9]/RTP_DATA[10])
EMA10 [EMIF]: RP4.13 U1.C8(D:EMIF_ADDR[10]/RTP_DATA[9])
EMA11 [EMIF]: RP6.7 U1.C9(D:EMIF_ADDR[11]/RTP_DATA[8])
EMA12 [EMIF]: RP6.3 U1.C10(D:EMIF_ADDR[12]/RTP_DATA[6])
EMA13 [EMIF]: RP6.1 U1.C11(D:EMIF_ADDR[13]/RTP_DATA[5])
EMA14 [EMIF]: RP5.15 U1.C12(D:EMIF_ADDR[14]/RTP_DATA[4])
EMA15 [EMIF]: RP5.13 U1.C13(D:EMIF_ADDR[15]/RTP_DATA[3])
EMA16 [EMIF]: RP5.11 U1.D14(D:EMIF_ADDR[16]/RTP_DATA[2])
EMA17 [EMIF]: RP5.9 U1.C14(D:EMIF_ADDR[17]/RTP_DATA[1])
EMA18 [EMIF]: RP5.7 U1.D15(D:EMIF_ADDR[18]/RTP_DATA[0])
EMA19 [EMIF]: RP5.5 U1.C15(D:EMIF_ADDR[19]/RTP_NENA)
EMA20 [EMIF]: RP5.3 U1.C16(D:EMIF_ADDR[20]/RTP_NSYNC)
EMA21 [EMIF]: RP5.1 U1.C17(D:EMIF_ADDR[21]/RTP_CLK)
EMBA1 [EMIF]: RP6.5 U1.D16(D:EMIF_BA[1]/N2HET2[5])
EMCAS [EMIF]: RP8.9 U1.R4(D:EMIF_NCAS/GIOB[3])
EMCKE [EMIF]: RP8.5 U1.L3(D:EMIF_CKE)
EMCLK [EMIF]: RP8.3 U1.K3(D:EMIF_CLK/ECLK2)
EMCS0 [EMIF]: RP1.1 U1.N17(D:EMIF_NCS[0]/RTP_DATA[15]/N2HET2[7])
EMCS2 [EMIF]: RP1.3 U1.L17(D:EMIF_NCS[2]/GIOB[4])
EMCS3 [EMIF]: RP1.5 U1.K17(D:EMIF_NCS[3]/RTP_DATA[14]/N2HET2[9])
EMCS4 [EMIF]: RP1.7 U1.M17(D:EMIF_NCS[4]/RTP_DATA[7]/GIOB[5])
EMIF_ADDR_0/N2HET2_1 [EMIF]: RP4.2 ; also sheet 13
EMIF_ADDR_1/N2HET2_3 [EMIF]: RP4.4 ; also sheet 13
EMIF_ADDR_6/RTP_DATA_13/N2HET2_11 [EMIF]: RP4.6 ; also sheet 13
EMIF_ADDR_7/RTP_DATA_12/N2HET2_13 [EMIF]: RP4.8 ; also sheet 13
EMIF_ADDR_8/RTP_DATA_11/N2HET2_15 [EMIF]: RP4.10 ; also sheet 13
EMIF_ADDR_9/RTP_DATA_10 [EMIF]: RP4.12 ; also sheet 13
EMIF_ADDR_10/RTP_DATA_9 [EMIF]: RP4.14 ; also sheet 13
EMIF_ADDR_11/RTP_DATA_8 [EMIF]: RP6.8 ; also sheet 13
EMIF_ADDR_12/RTP_DATA_6 [EMIF]: RP6.4 ; also sheet 13
EMIF_ADDR_13/RTP_DATA_5 [EMIF]: RP6.2 ; also sheet 13
EMIF_ADDR_14/RTP_DATA_4 [EMIF]: RP5.16 ; also sheet 13
EMIF_ADDR_15/RTP_DATA_3 [EMIF]: RP5.14 ; also sheet 13
EMIF_ADDR_16/RTP_DATA_2 [EMIF]: RP5.12 ; also sheet 13
EMIF_ADDR_17/RTP_DATA_1 [EMIF]: RP5.10 ; also sheet 13
EMIF_ADDR_18/RTP_DATA_0 [EMIF]: RP5.8 ; also sheet 13
EMIF_ADDR_19/RTP_NENA [EMIF]: RP5.6 ; also sheet 13
EMIF_ADDR_20/RTP_NSYNC [EMIF]: RP5.4 ; also sheet 13
EMIF_ADDR_21/RTP_CLK [EMIF]: RP5.2 ; also sheet 13
EMIF_BA_1/N2HET2_5 [EMIF]: RP6.6 ; also sheet 13
EMIF_CKE [EMIF]: RP8.6 ; also sheet 14
EMIF_CLK/ECLK2 [EMIF]: RP8.4 ; also sheet 14
EMIF_NCAS/GIOB_3 [EMIF]: RP8.10 ; also sheet 14
EMIF_NCS_0/RTP_DATA_15/N2HET2_7 [EMIF]: RP1.2 ; also sheet 13
EMIF_NCS_2/GIOB_4 [EMIF]: RP1.4 ; also sheet 13
EMIF_NCS_3/RTP_DATA_14/N2HET2_9 [EMIF]: RP1.6 ; also sheet 13
EMIF_NCS_4/RTP_DATA_7/GIOB_5 [EMIF]: RP1.8 ; also sheet 13
EMIF_NRAS/GIOB_6 [EMIF]: RP8.8 ; also sheet 14
EMIF_NWAIT/GIOB_7 [EMIF]: U1.P3(D:EMIF_NWAIT/GIOB[7]) ; also sheet 14
EMIF_NWE/EMIF_RNW [EMIF]: RP2.16 ; also sheet 13
EMRAS [EMIF]: RP8.7 U1.R3(D:EMIF_NRAS/GIOB[6])
EMWE [EMIF]: RP2.15 U1.D17(D:EMIF_NWE/EMIF_RNW)
ETD0 [ETM]: RP7.15 U1.R12(D:ETMDATA[0])
ETD1 [ETM]: RP7.13 U1.R13(D:ETMDATA[1])
ETD2 [ETM]: RP2.1 U1.J15(D:ETMDATA[2])
ETD3 [ETM]: RP2.3 U1.H15(D:ETMDATA[3])
ETD4 [ETM]: RP2.5 U1.G15(D:ETMDATA[4])
ETD5 [ETM]: RP2.7 U1.F15(D:ETMDATA[5])
ETD6 [ETM]: RP2.9 U1.E15(D:ETMDATA[6])
ETD7 [ETM]: RP2.11 U1.E14(D:ETMDATA[7])
ETD8 [ETM]: RP2.13 U1.E9(D:ETMDATA[8]/EMIF_ADDR[5])
ETD9 [ETM]: RP3.15 U1.E8(D:ETMDATA[9]/EMIF_ADDR[4])
ETD10 [ETM]: RP3.13 U1.E7(D:ETMDATA[10]/EMIF_ADDR[3])
ETD11 [ETM]: RP3.11 U1.E6(D:ETMDATA[11]/EMIF_ADDR[2])
ETD12 [ETM]: RP6.9 U1.E13(D:ETMDATA[12]/EMIF_BA[0])
ETD13 [ETM]: RP6.11 U1.E12(D:ETMDATA[13]/EMIF_NOE)
ETD14 [ETM]: RP6.13 U1.E11(D:ETMDATA[14]/EMIF_NDQM[1])
ETD15 [ETM]: RP6.15 U1.E10(D:ETMDATA[15]/EMIF_NDQM[0])
ETD16 [ETM]: RP1.15 U1.K15(D:ETMDATA[16]/EMIF_DATA[0])
ETD17 [ETM]: RP1.13 U1.L15(D:ETMDATA[17]/EMIF_DATA[1])
ETD18 [ETM]: RP1.11 U1.M15(D:ETMDATA[18]/EMIF_DATA[2])
ETD19 [ETM]: RP1.9 U1.N15(D:ETMDATA[19]/EMIF_DATA[3])
ETD20 [ETM]: RP3.9 U1.E5(D:ETMDATA[20]/EMIF_DATA[4])
ETD21 [ETM]: RP3.7 U1.F5(D:ETMDATA[21]/EMIF_DATA[5])
ETD22 [ETM]: RP3.5 U1.G5(D:ETMDATA[22]/EMIF_DATA[6])
ETD23 [ETM]: RP3.3 U1.K5(D:ETMDATA[23]/EMIF_DATA[7])
ETD24 [ETM]: RP3.1 U1.L5(D:ETMDATA[24]/EMIF_DATA[8]/N2HET2[24]/MIBSPI5NCS[4])
ETD25 [ETM]: RP4.15 U1.M5(D:ETMDATA[25]/EMIF_DATA[9]/N2HET2[25]/MIBSPI5NCS[5])
ETD26 [ETM]: RP8.11 U1.N5(D:ETMDATA[26]/EMIF_DATA[10]/N2HET2[26])
ETD27 [ETM]: RP8.13 U1.P5(D:ETMDATA[27]/EMIF_DATA[11]/N2HET2[27])
ETD28 [ETM]: RP8.15 U1.R5(D:ETMDATA[28]/EMIF_DATA[12]/N2HET2[28]/GIOA[0])
ETD29 [ETM]: RP7.1 U1.R6(D:ETMDATA[29]/EMIF_DATA[13]/N2HET2[29]/GIOA[1])
ETD30 [ETM]: RP7.3 U1.R7(D:ETMDATA[30]/EMIF_DATA[14]/N2HET2[30]/GIOA[3])
ETD31 [ETM]: RP7.5 U1.R8(D:ETMDATA[31]/EMIF_DATA[15]/N2HET2[31]/GIOA[4])
ETD32 [ETM]: RP7.7 U1.R9(D:ETMTRACECLKIN/EXTCLKIN2/GIOA[5])
ETD33 [ETM]: RP7.11 U1.R10(D:ETMTRACECLKOUT/GIOA[6])
ETD34 [ETM]: RP7.9 U1.R11(D:ETMTRACECTL/GIOA[7])
ETMDATA_0: RP7.16 ; also sheet 14
ETMDATA_1: RP7.14 ; also sheet 14
ETMDATA_2: RP2.2 ; also sheet 13
ETMDATA_3: RP2.4 ; also sheet 13
ETMDATA_4: RP2.6 ; also sheet 13
ETMDATA_5: RP2.8 ; also sheet 13
ETMDATA_6: RP2.10 ; also sheet 13
ETMDATA_7: RP2.12 ; also sheet 13
ETMDATA_8/EMIF_ADDR_5: RP2.14 ; also sheet 13
ETMDATA_9/EMIF_ADDR_4: RP3.16 ; also sheet 13
ETMDATA_10/EMIF_ADDR_3: RP3.14 ; also sheet 13
ETMDATA_11/EMIF_ADDR_2: RP3.12 ; also sheet 13
ETMDATA_12/EMIF_BA_0: RP6.10 ; also sheet 13
ETMDATA_13/EMIF_NOE: RP6.12 ; also sheet 13
ETMDATA_14/EMIF_NDQM_1: RP6.14 ; also sheet 13
ETMDATA_15/EMIF_NDQM_0: RP6.16 ; also sheet 13
ETMDATA_16/EMIF_DATA_0: RP1.16 ; also sheet 13
ETMDATA_17/EMIF_DATA_1: RP1.14 ; also sheet 13
ETMDATA_18/EMIF_DATA_2: RP1.12 ; also sheet 13
ETMDATA_19/EMIF_DATA_3: RP1.10 ; also sheet 13
ETMDATA_20/EMIF_DATA_4: RP3.10 ; also sheet 13
ETMDATA_21/EMIF_DATA_5: RP3.8 ; also sheet 13
ETMDATA_22/EMIF_DATA_6: RP3.6 ; also sheet 13
ETMDATA_23/EMIF_DATA_7: RP3.4 ; also sheet 13
ETMDATA_24/EMIF_DATA_8/N2HET2_24/MIBSPI5NCS_4: RP3.2 ; also sheet 13
ETMDATA_25/EMIF_DATA_9/N2HET2_25/MIBSPI5NCS_5: RP4.16 ; also sheet 13
ETMDATA_26/EMIF_DATA_10/N2HET2_26: RP8.12 ; also sheet 14
ETMDATA_27/EMIF_DATA_11/N2HET2_27: RP8.14 ; also sheet 14
ETMDATA_28/EMIF_DATA_12/N2HET2_28/GIOA_0: RP8.16 ; also sheet 14
ETMDATA_29/EMIF_DATA_13/N2HET2_29/GIOA_1: RP7.2 ; also sheet 14
ETMDATA_30/EMIF_DATA_14/N2HET2_30/GIOA_3: RP7.4 ; also sheet 14
ETMDATA_31/EMIF_DATA_15/N2HET2_31/GIOA_4: RP7.6 ; also sheet 14
ETMTRACECLKIN/EXTCLKIN2/GIOA_5: RP7.8 ; also sheet 14
ETMTRACECLKOUT/GIOA_6: RP7.12 ; also sheet 14
ETMTRACECTL/GIOA_7: RP7.10 ; also sheet 14
GND [pwr]: C3.2 RP9.1 S1.1 S1.2 S2.1 S2.2 U2.2(GND) ; also sheet 2,3,6,7,8,9,10,11,12,13,14,15,16,17
HERCULES_MR_PB: S1.3 S1.4 U2.3(*MR) ; also sheet 3,13,15
HERCULES_NRST: C3.1 RP10.4 S2.3 S2.4 U1.B17(D:NRST) ; also sheet 7,8,9,13,15
N$34: LED1.C RP10.6
NERROR: RP10.5 U1.B14(D:NERROR) ; also sheet 9,13
NPORRST: RP10.2 U1.W7(D:NPORRST) U2.1(*RSTVDD) U2.5(*RSTSENSE)
SENSE: RP9.2 RP9.3 U2.4(SENSE)
Unconnected: RP9.13 RP9.14 RP10.7 RP10.8 RP10.9 RP10.10 RP10.11 RP10.12 RP10.13 RP10.14 RP10.15 RP10.16 U1.H5(D:FLTP2) U1.J5(D:FLTP1)

### Notes on the sheet
- ERROR
  LED
- SENSE THRESHOLD 
  0.542V - 0.559V
- POWER ON
  RESET
- WARM
  RESET

## Sheet 6 of 17
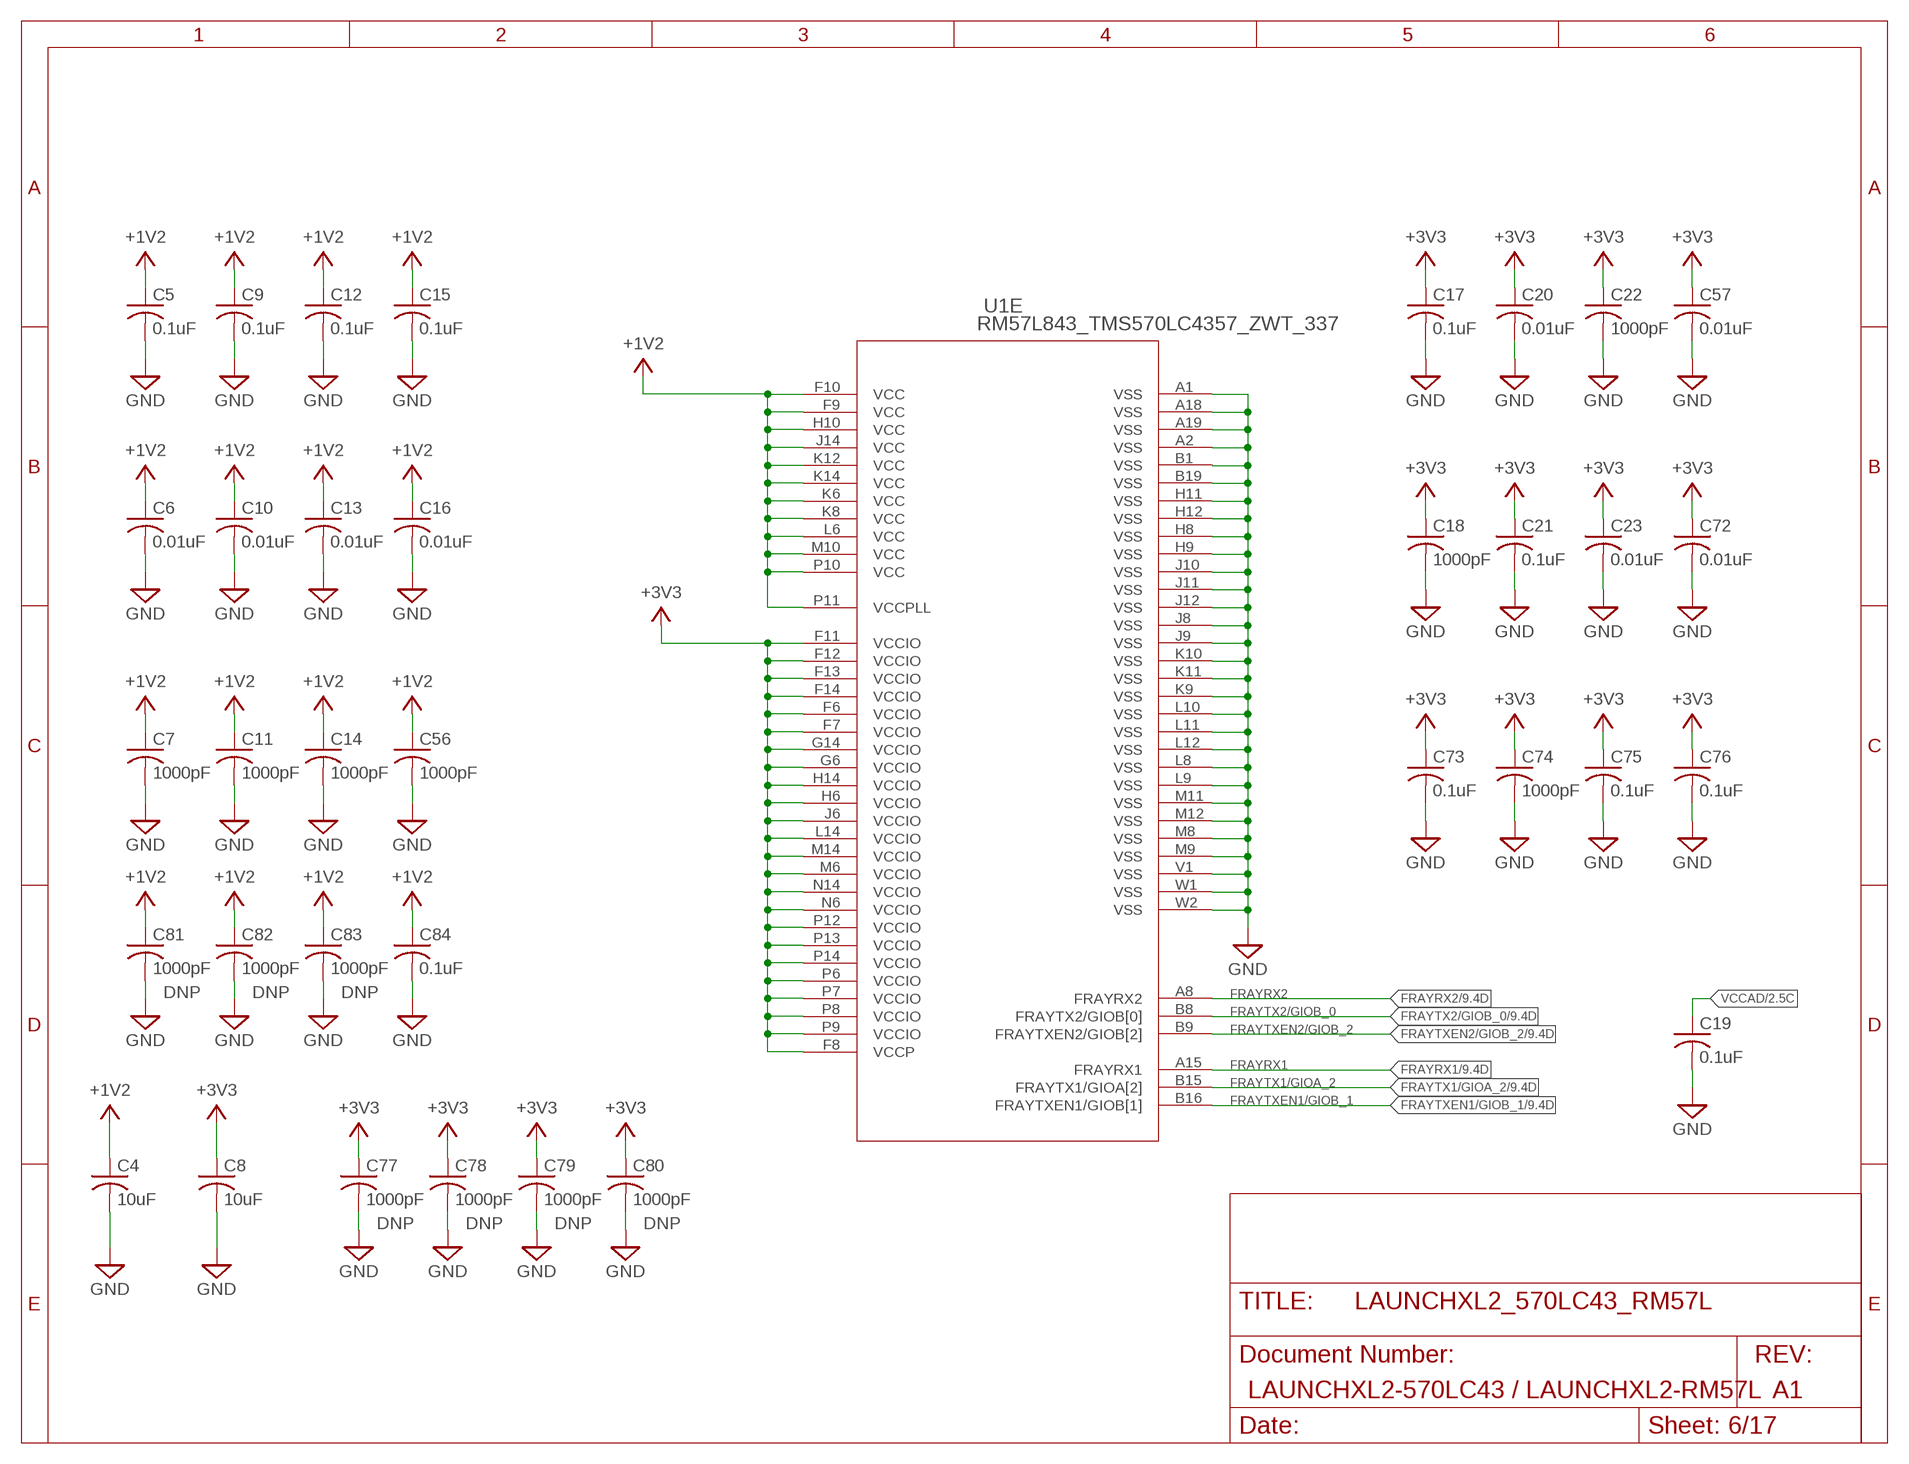
[diagram p5: schematic, sheet 6]

### Parts
C4  10uF  C-USC0805K  [C0805K]
C5  0.1uF  C-USC0201  [C0201]
C6  0.01uF  C-USC0201  [C0201]
C7  1000pF  C-USC0201  [C0201]
C8  10uF  C-USC0805K  [C0805K]
C9  0.1uF  C-USC0201  [C0201]
C10  0.01uF  C-USC0201  [C0201]
C11  1000pF  C-USC0201  [C0201]
C12  0.1uF  C-USC0201  [C0201]
C13  0.01uF  C-USC0201  [C0201]
C14  1000pF  C-USC0201  [C0201]
C15  0.1uF  C-USC0201  [C0201]
C16  0.01uF  C-USC0201  [C0201]
C17  0.1uF  C-USC0201  [C0201]
C18  1000pF  C-USC0201  [C0201]
C19  0.1uF  C-USC0201  [C0201]
C20  0.01uF  C-USC0201  [C0201]
C21  0.1uF  C-USC0201  [C0201]
C22  1000pF  C-USC0201  [C0201]
C23  0.01uF  C-USC0201  [C0201]
C56  1000pF  C-USC0201  [C0201]
C57  0.01uF  C-USC0201  [C0201]
C72  0.01uF  C-USC0201  [C0201]
C73  0.1uF  C-USC0201  [C0201]
C74  1000pF  C-USC0201  [C0201]
C75  0.1uF  C-USC0201  [C0201]
C76  0.1uF  C-USC0201  [C0201]
C77  1000pF  C-USC0201  [C0201]
C78  1000pF  C-USC0201  [C0201]
C79  1000pF  C-USC0201  [C0201]
C80  1000pF  C-USC0201  [C0201]
C81  1000pF  C-USC0201  [C0201]
C82  1000pF  C-USC0201  [C0201]
C83  1000pF  C-USC0201  [C0201]
C84  0.1uF  C-USC0201  [C0201]

### Nets
+1V2 [pwr]: C4.1 C5.1 C6.1 C7.1 C9.1 C10.1 C11.1 C12.1 C13.1 C14.1 C15.1 C16.1 C56.1 C81.1 C82.1 C83.1 C84.1 U1.F9(E:VCC) U1.F10(E:VCC) U1.H10(E:VCC) U1.J14(E:VCC) U1.K6(E:VCC) U1.K8(E:VCC) U1.K12(E:VCC) U1.K14(E:VCC) U1.L6(E:VCC) U1.M10(E:VCC) U1.P10(E:VCC) U1.P11(E:VCCPLL) ; also sheet 5,11,15
+3V3 [pwr]: C8.1 C17.1 C18.1 C20.1 C21.1 C22.1 C23.1 C57.1 C72.1 C73.1 C74.1 C75.1 C76.1 C77.1 C78.1 C79.1 C80.1 U1.F6(E:VCCIO) U1.F7(E:VCCIO) U1.F8(E:VCCP) U1.F11(E:VCCIO) U1.F12(E:VCCIO) U1.F13(E:VCCIO) U1.F14(E:VCCIO) U1.G6(E:VCCIO) U1.G14(E:VCCIO) U1.H6(E:VCCIO) U1.H14(E:VCCIO) U1.J6(E:VCCIO) U1.L14(E:VCCIO) U1.M6(E:VCCIO) U1.M14(E:VCCIO) U1.N6(E:VCCIO) U1.N14(E:VCCIO) U1.P6(E:VCCIO) U1.P7(E:VCCIO) U1.P8(E:VCCIO) U1.P9(E:VCCIO) U1.P12(E:VCCIO) U1.P13(E:VCCIO) U1.P14(E:VCCIO) ; also sheet 2,3,5,7,8,9,10,11,12,13,14,15,16
FRAYRX1: U1.A15(E:FRAYRX1) ; also sheet 9
FRAYRX2: U1.A8(E:FRAYRX2) ; also sheet 9
FRAYTX1/GIOA_2: U1.B15(E:FRAYTX1/GIOA[2]) ; also sheet 9
FRAYTX2/GIOB_0: U1.B8(E:FRAYTX2/GIOB[0]) ; also sheet 9
FRAYTXEN1/GIOB_1: U1.B16(E:FRAYTXEN1/GIOB[1]) ; also sheet 9
FRAYTXEN2/GIOB_2: U1.B9(E:FRAYTXEN2/GIOB[2]) ; also sheet 9
GND [pwr]: C4.2 C5.2 C6.2 C7.2 C8.2 C9.2 C10.2 C11.2 C12.2 C13.2 C14.2 C15.2 C16.2 C17.2 C18.2 C19.2 C20.2 C21.2 C22.2 C23.2 C56.2 C57.2 C72.2 C73.2 C74.2 C75.2 C76.2 C77.2 C78.2 C79.2 C80.2 C81.2 C82.2 C83.2 C84.2 U1.A1(E:VSS) U1.A2(E:VSS) U1.A18(E:VSS) U1.A19(E:VSS) U1.B1(E:VSS) U1.B19(E:VSS) U1.H8(E:VSS) U1.H9(E:VSS) U1.H11(E:VSS) U1.H12(E:VSS) U1.J8(E:VSS) U1.J9(E:VSS) U1.J10(E:VSS) U1.J11(E:VSS) U1.J12(E:VSS) U1.K9(E:VSS) U1.K10(E:VSS) U1.K11(E:VSS) U1.L8(E:VSS) U1.L9(E:VSS) U1.L10(E:VSS) U1.L11(E:VSS) U1.L12(E:VSS) U1.M8(E:VSS) U1.M9(E:VSS) U1.M11(E:VSS) U1.M12(E:VSS) U1.V1(E:VSS) U1.W1(E:VSS) U1.W2(E:VSS) ; also sheet 2,3,5,7,8,9,10,11,12,13,14,15,16,17
VCCAD: C19.1 ; also sheet 2

## Sheet 7 of 17
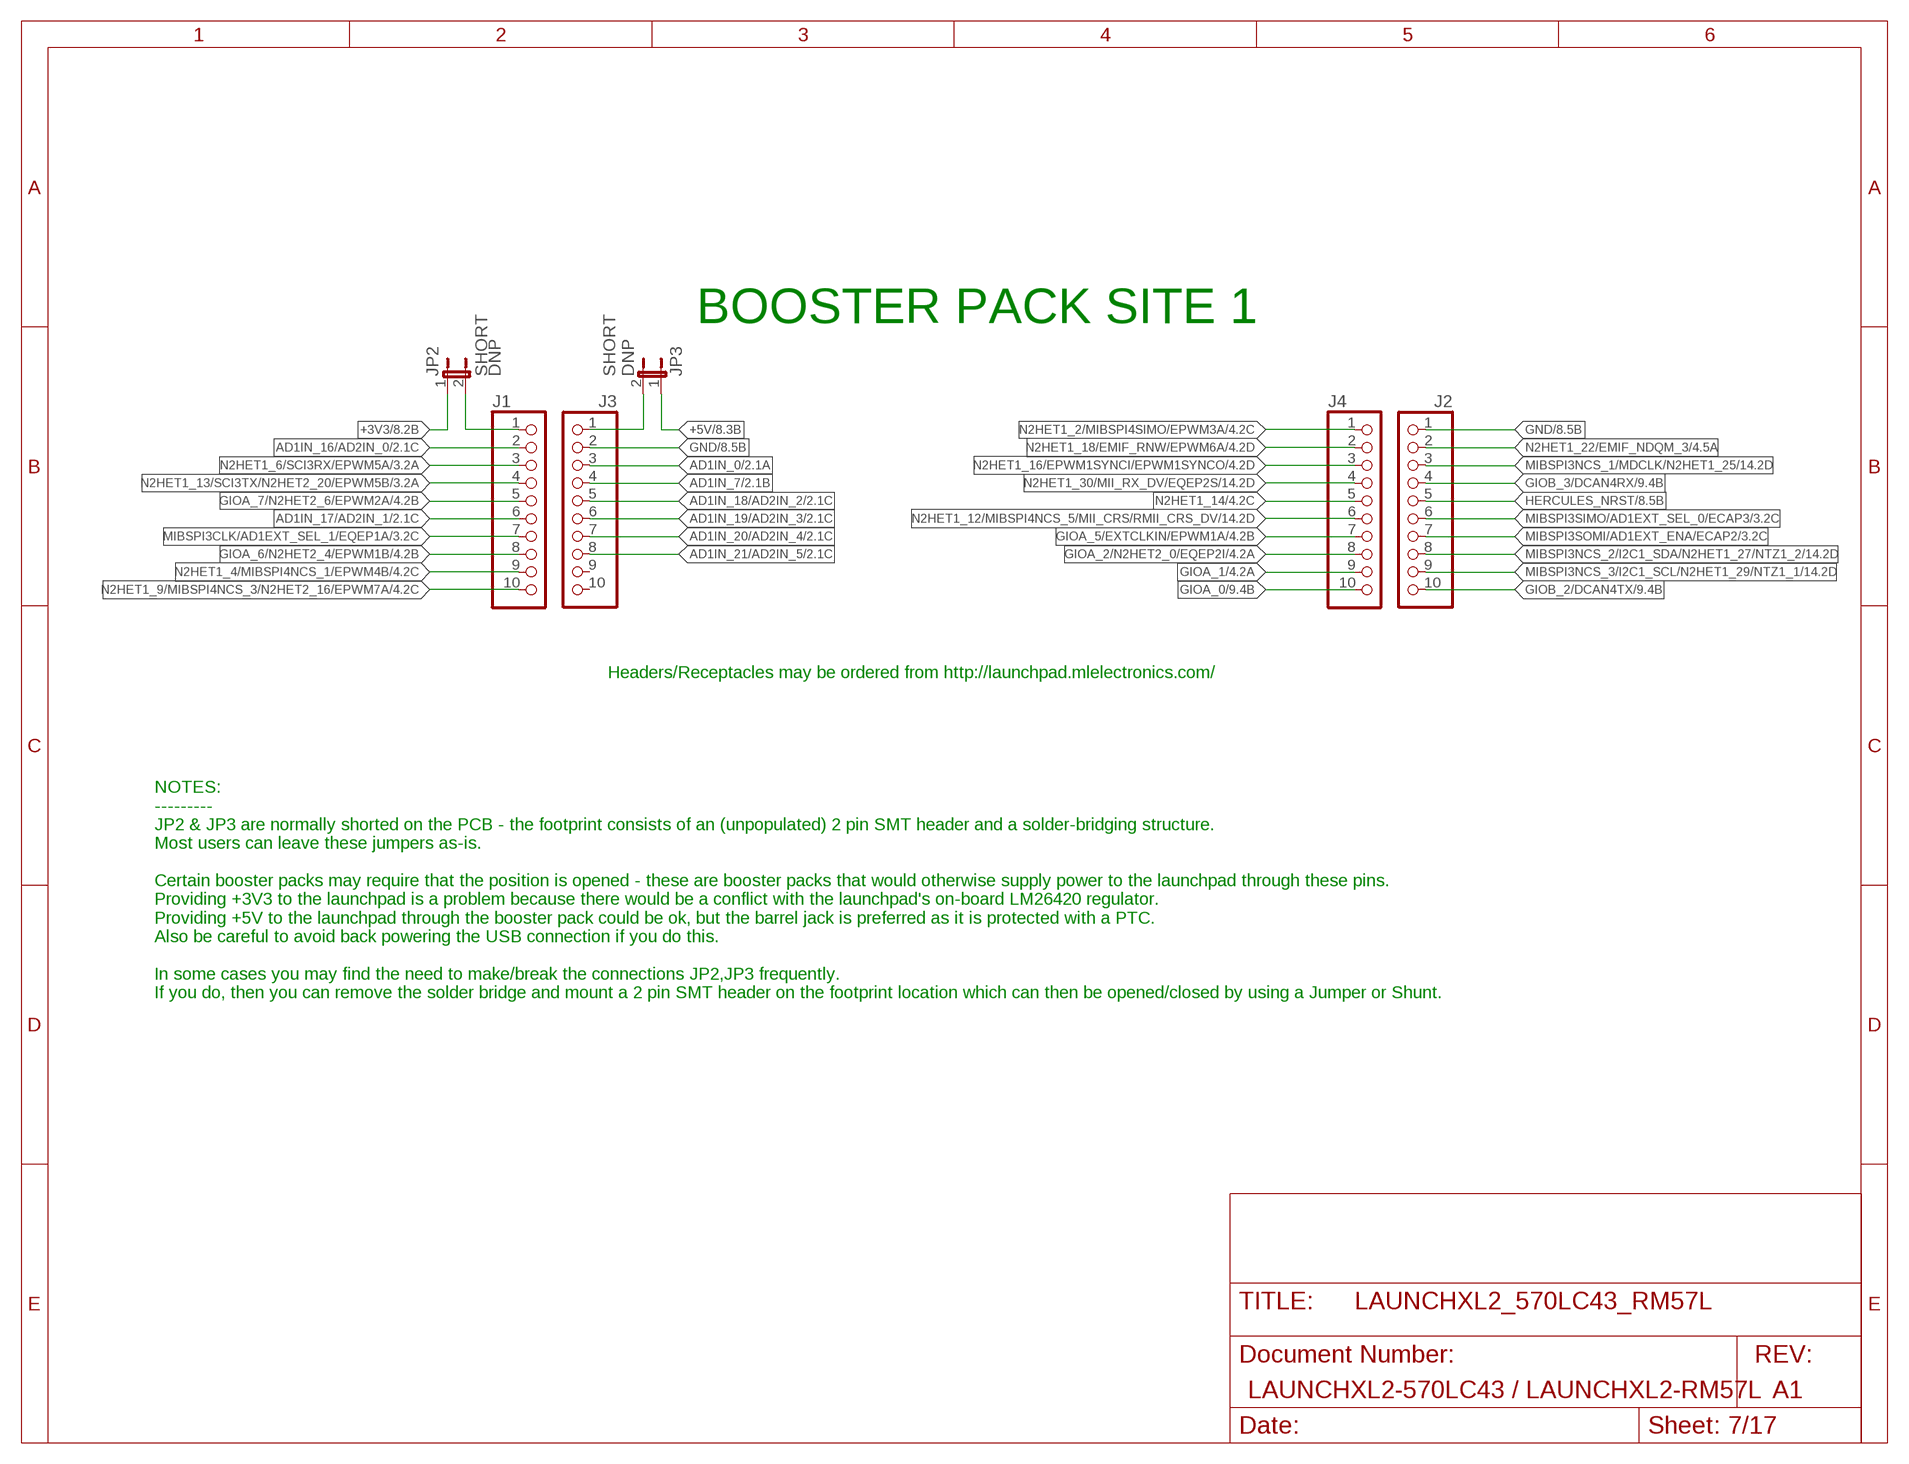
[diagram p6: schematic, sheet 7]

### Parts
J1  PINHD-1X10  [1X10]
J2  PINHD-1X10  [1X10]
J3  PINHD-1X10  [1X10]
J4  PINHD-1X10  [1X10]
JP2  SHORT  JP1EJP1_SHORT  [JP1_SHORT]
JP3  SHORT  JP1EJP1_SHORT  [JP1_SHORT]

### Nets
+3V3 [pwr]: JP2.1 ; also sheet 2,3,5,6,8,9,10,11,12,13,14,15,16
+5V [pwr]: JP3.1 ; also sheet 2,8,9,11,17
AD1IN_0: J3.3 ; also sheet 2
AD1IN_7: J3.4 ; also sheet 2
AD1IN_16/AD2IN_0: J1.2 ; also sheet 2
AD1IN_17/AD2IN_1: J1.6 ; also sheet 2
AD1IN_18/AD2IN_2: J3.5 ; also sheet 2
AD1IN_19/AD2IN_3: J3.6 ; also sheet 2
AD1IN_20/AD2IN_4: J3.7 ; also sheet 2
AD1IN_21/AD2IN_5: J3.8 ; also sheet 2
GIOA_0: J4.10 ; also sheet 4,9
GIOA_1: J4.9 ; also sheet 4
GIOA_2/N2HET2_0/EQEP2I: J4.8 ; also sheet 4
GIOA_5/EXTCLKIN/EPWM1A: J4.7 ; also sheet 4
GIOA_6/N2HET2_4/EPWM1B: J1.8 ; also sheet 4
GIOA_7/N2HET2_6/EPWM2A: J1.5 ; also sheet 4
GIOB_2/DCAN4TX: J2.10 ; also sheet 4,9,14
GIOB_3/DCAN4RX: J2.4 ; also sheet 4,9,14
GND [pwr]: J2.1 J3.2 ; also sheet 2,3,5,6,8,9,10,11,12,13,14,15,16,17
HERCULES_NRST: J2.5 ; also sheet 5,8,9,13,15
MIBSPI3CLK/AD1EXT_SEL_1/EQEP1A: J1.7 ; also sheet 3
MIBSPI3NCS_1/MDCLK/N2HET1_25: J2.3 ; also sheet 3,14
MIBSPI3NCS_2/I2C1_SDA/N2HET1_27/NTZ1_2: J2.8 ; also sheet 3,14
MIBSPI3NCS_3/I2C1_SCL/N2HET1_29/NTZ1_1: J2.9 ; also sheet 3,14
MIBSPI3SIMO/AD1EXT_SEL_0/ECAP3: J2.6 ; also sheet 3
MIBSPI3SOMI/AD1EXT_ENA/ECAP2: J2.7 ; also sheet 3
N2HET1_2/MIBSPI4SIMO/EPWM3A: J4.1 ; also sheet 4
N2HET1_4/MIBSPI4NCS_1/EPWM4B: J1.9 ; also sheet 4
N2HET1_6/SCI3RX/EPWM5A: J1.3 ; also sheet 3
N2HET1_9/MIBSPI4NCS_3/N2HET2_16/EPWM7A: J1.10 ; also sheet 4
N2HET1_12/MIBSPI4NCS_5/MII_CRS/RMII_CRS_DV: J4.6 ; also sheet 4,14
N2HET1_13/SCI3TX/N2HET2_20/EPWM5B: J1.4 ; also sheet 3
N2HET1_14: J4.5 ; also sheet 4
N2HET1_16/EPWM1SYNCI/EPWM1SYNCO: J4.3 ; also sheet 4
N2HET1_18/EMIF_RNW/EPWM6A: J4.2 ; also sheet 4
N2HET1_22/EMIF_NDQM_3: J2.2 ; also sheet 4
N2HET1_30/MII_RX_DV/EQEP2S: J4.4 ; also sheet 4,14
N$3: J1.1 JP2.2
N$4: J3.1 JP3.2
Unconnected: J3.9 J3.10

### Notes on the sheet
- BOOSTER PACK SITE 1
- Headers/Receptacles may be ordered from http://launchpad.mlelectronics.com/
- NOTES:
  ---------
  JP2 & JP3 are normally shorted on the PCB - the footprint consists of an (unpopulated) 2 pin SMT header and a solder-bridging structure.
  Most users can leave these jumpers as-is. 
  
  Certain booster packs may require that the position is opened - these are booster packs that would otherwise supply power to the launchpad through these pins.    
  Providing +3V3 to the launchpad is a problem because there would be a conflict with the launchpad's on-board LM26420 regulator.   
  Providing +5V to the launchpad through the booster pack could be ok, but the barrel jack is preferred as it is protected with a PTC. 
  Also be careful to avoid back powering the USB connection if you do this. 
  
  In some cases you may find the need to make/break the connections JP2,JP3 frequently.  
  If you do, then you can remove the solder bridge and mount a 2 pin SMT header on the footprint location which can then be opened/closed by using a Jumper or Shunt.

## Sheet 8 of 17
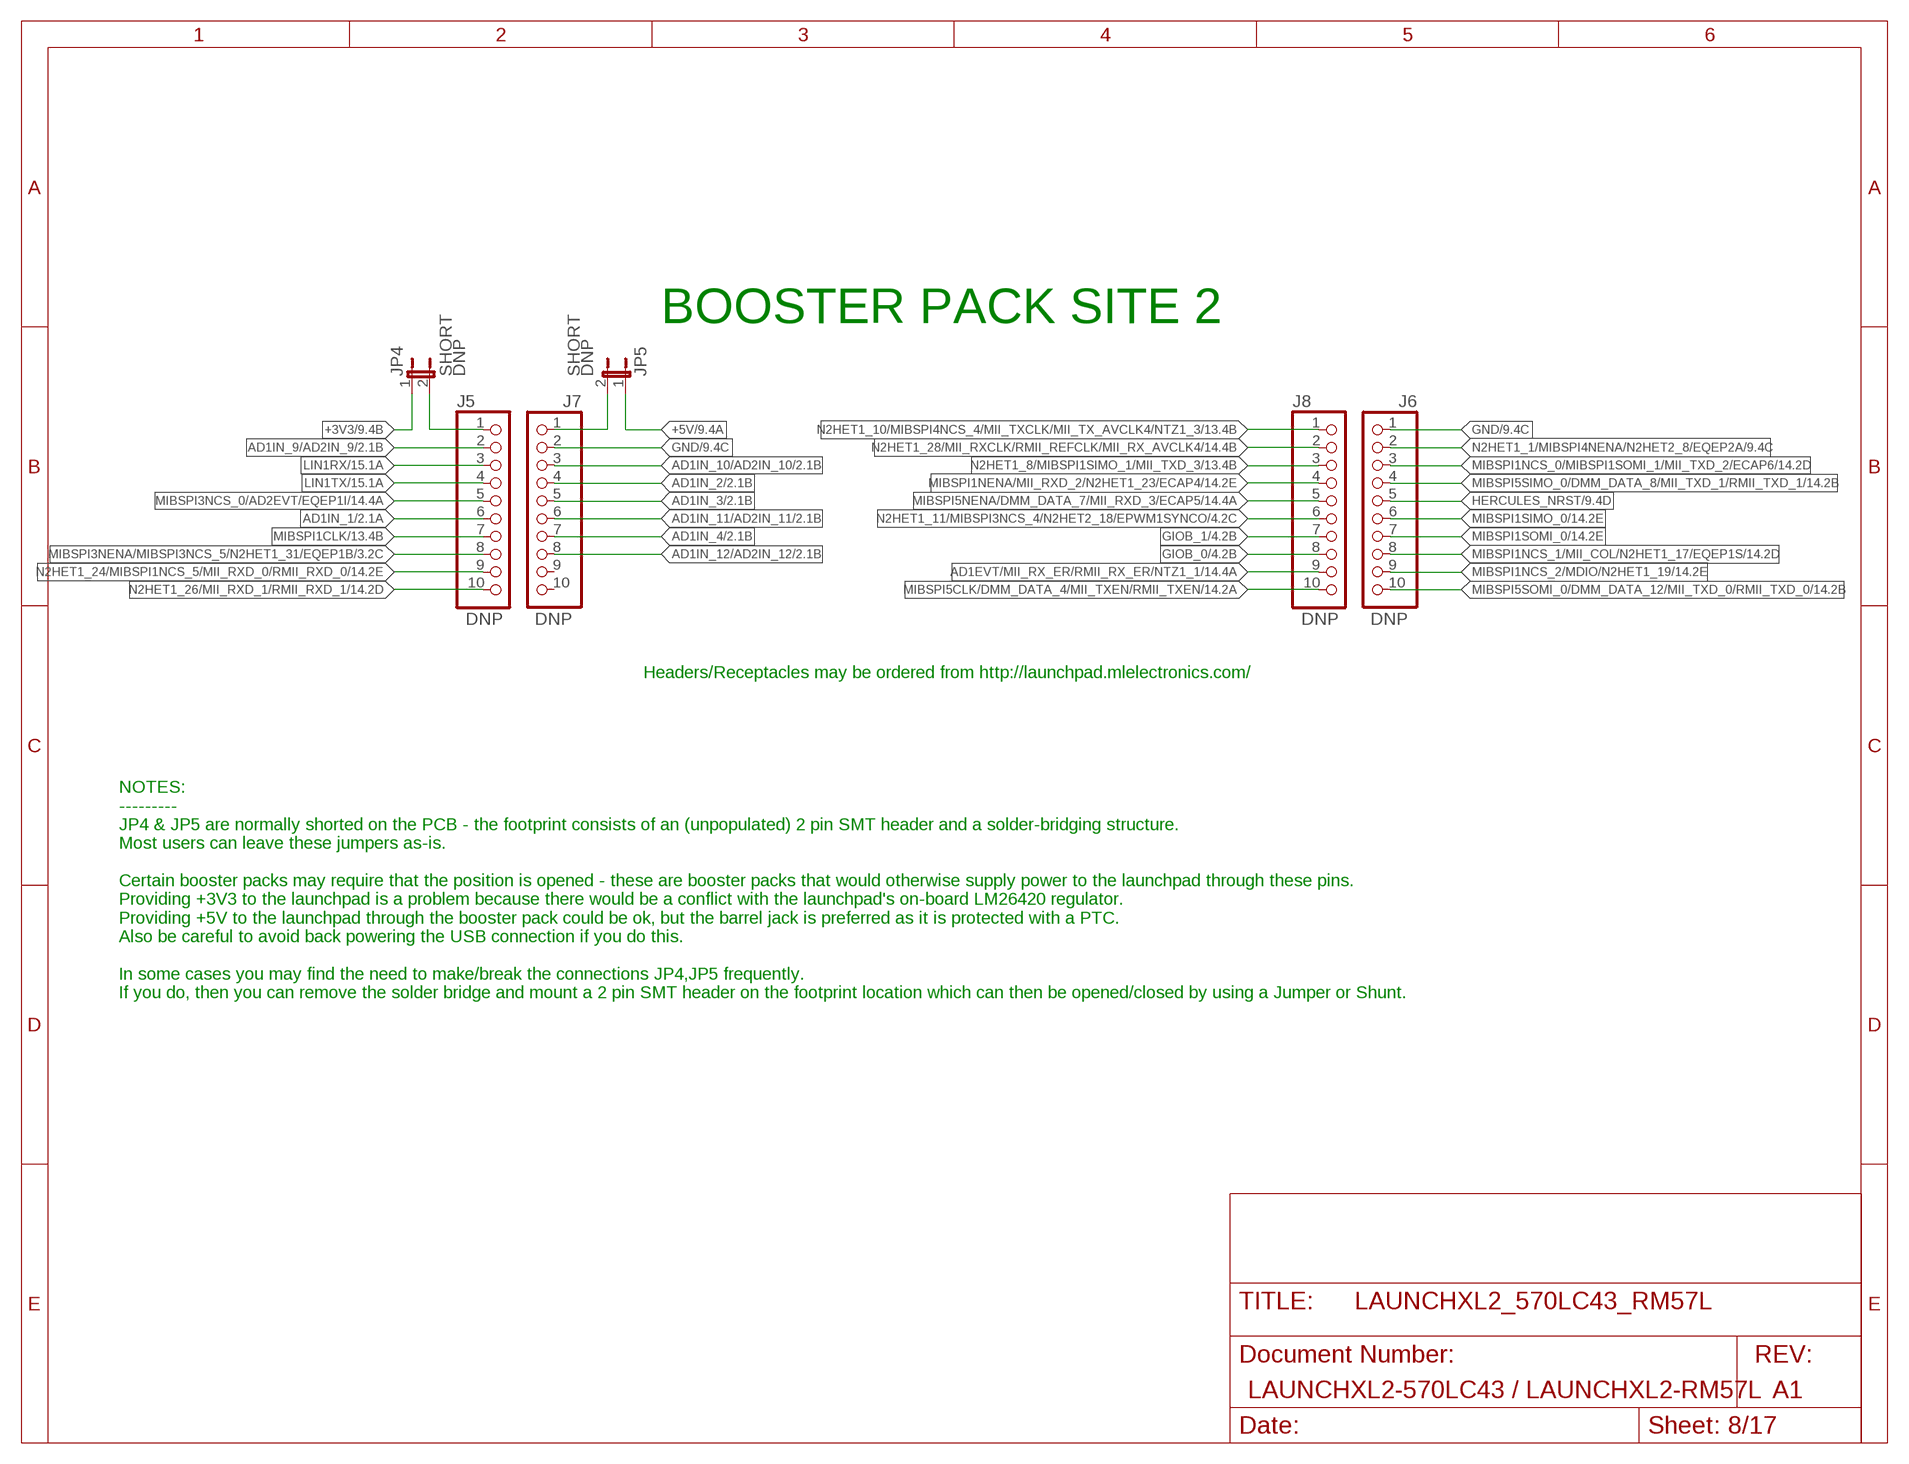
[diagram p7: schematic, sheet 8]

### Parts
J5  PINHD-1X10  [1X10]
J6  PINHD-1X10  [1X10]
J7  PINHD-1X10  [1X10]
J8  PINHD-1X10  [1X10]
JP4  SHORT  JP1EJP1_SHORT  [JP1_SHORT]
JP5  SHORT  JP1EJP1_SHORT  [JP1_SHORT]

### Nets
+3V3 [pwr]: JP4.1 ; also sheet 2,3,5,6,7,9,10,11,12,13,14,15,16
+5V [pwr]: JP5.1 ; also sheet 2,7,9,11,17
AD1EVT/MII_RX_ER/RMII_RX_ER/NTZ1_1: J8.9 ; also sheet 2,14
AD1IN_1: J5.6 ; also sheet 2
AD1IN_2: J7.4 ; also sheet 2
AD1IN_3: J7.5 ; also sheet 2
AD1IN_4: J7.7 ; also sheet 2
AD1IN_9/AD2IN_9: J5.2 ; also sheet 2
AD1IN_10/AD2IN_10: J7.3 ; also sheet 2
AD1IN_11/AD2IN_11: J7.6 ; also sheet 2
AD1IN_12/AD2IN_12: J7.8 ; also sheet 2
GIOB_0: J8.8 ; also sheet 4
GIOB_1: J8.7 ; also sheet 4
GND [pwr]: J6.1 J7.2 ; also sheet 2,3,5,6,7,9,10,11,12,13,14,15,16,17
HERCULES_NRST: J6.5 ; also sheet 5,7,9,13,15
LIN1RX: J5.3 ; also sheet 3,15
LIN1TX: J5.4 ; also sheet 3,15
MIBSPI1CLK: J5.7 ; also sheet 3,13,14
MIBSPI1NCS_0/MIBSPI1SOMI_1/MII_TXD_2/ECAP6: J6.3 ; also sheet 3,14
MIBSPI1NCS_1/MII_COL/N2HET1_17/EQEP1S: J6.8 ; also sheet 3,14
MIBSPI1NCS_2/MDIO/N2HET1_19: J6.9 ; also sheet 3,14
MIBSPI1NENA/MII_RXD_2/N2HET1_23/ECAP4: J8.4 ; also sheet 3,14
MIBSPI1SIMO_0: J6.6 ; also sheet 3,14
MIBSPI1SOMI_0: J6.7 ; also sheet 3,14
MIBSPI3NCS_0/AD2EVT/EQEP1I: J5.5 ; also sheet 3,14
MIBSPI3NENA/MIBSPI3NCS_5/N2HET1_31/EQEP1B: J5.8 ; also sheet 3
MIBSPI5CLK/DMM_DATA_4/MII_TXEN/RMII_TXEN: J8.10 ; also sheet 3,14
MIBSPI5NENA/DMM_DATA_7/MII_RXD_3/ECAP5: J8.5 ; also sheet 3,14
MIBSPI5SIMO_0/DMM_DATA_8/MII_TXD_1/RMII_TXD_1: J6.4 ; also sheet 3,14
MIBSPI5SOMI_0/DMM_DATA_12/MII_TXD_0/RMII_TXD_0: J6.10 ; also sheet 3,14
N2HET1_1/MIBSPI4NENA/N2HET2_8/EQEP2A: J6.2 ; also sheet 4,9,14
N2HET1_8/MIBSPI1SIMO_1/MII_TXD_3: J8.3 ; also sheet 4,13
N2HET1_10/MIBSPI4NCS_4/MII_TXCLK/MII_TX_AVCLK4/NTZ1_3: J8.1 ; also sheet 4,13
N2HET1_11/MIBSPI3NCS_4/N2HET2_18/EPWM1SYNCO: J8.6 ; also sheet 4
N2HET1_24/MIBSPI1NCS_5/MII_RXD_0/RMII_RXD_0: J5.9 ; also sheet 4,14
N2HET1_26/MII_RXD_1/RMII_RXD_1: J5.10 ; also sheet 4,14
N2HET1_28/MII_RXCLK/RMII_REFCLK/MII_RX_AVCLK4: J8.2 ; also sheet 4,14
N$5: J5.1 JP4.2
N$14: J7.1 JP5.2
Unconnected: J7.9 J7.10

### Notes on the sheet
- BOOSTER PACK SITE 2
- Headers/Receptacles may be ordered from http://launchpad.mlelectronics.com/
- NOTES:
  ---------
  JP4 & JP5 are normally shorted on the PCB - the footprint consists of an (unpopulated) 2 pin SMT header and a solder-bridging structure.
  Most users can leave these jumpers as-is. 
  
  Certain booster packs may require that the position is opened - these are booster packs that would otherwise supply power to the launchpad through these pins.    
  Providing +3V3 to the launchpad is a problem because there would be a conflict with the launchpad's on-board LM26420 regulator.   
  Providing +5V to the launchpad through the booster pack could be ok, but the barrel jack is preferred as it is protected with a PTC. 
  Also be careful to avoid back powering the USB connection if you do this. 
  
  In some cases you may find the need to make/break the connections JP4,JP5 frequently.  
  If you do, then you can remove the solder bridge and mount a 2 pin SMT header on the footprint location which can then be opened/closed by using a Jumper or Shunt.

## Sheet 9 of 17
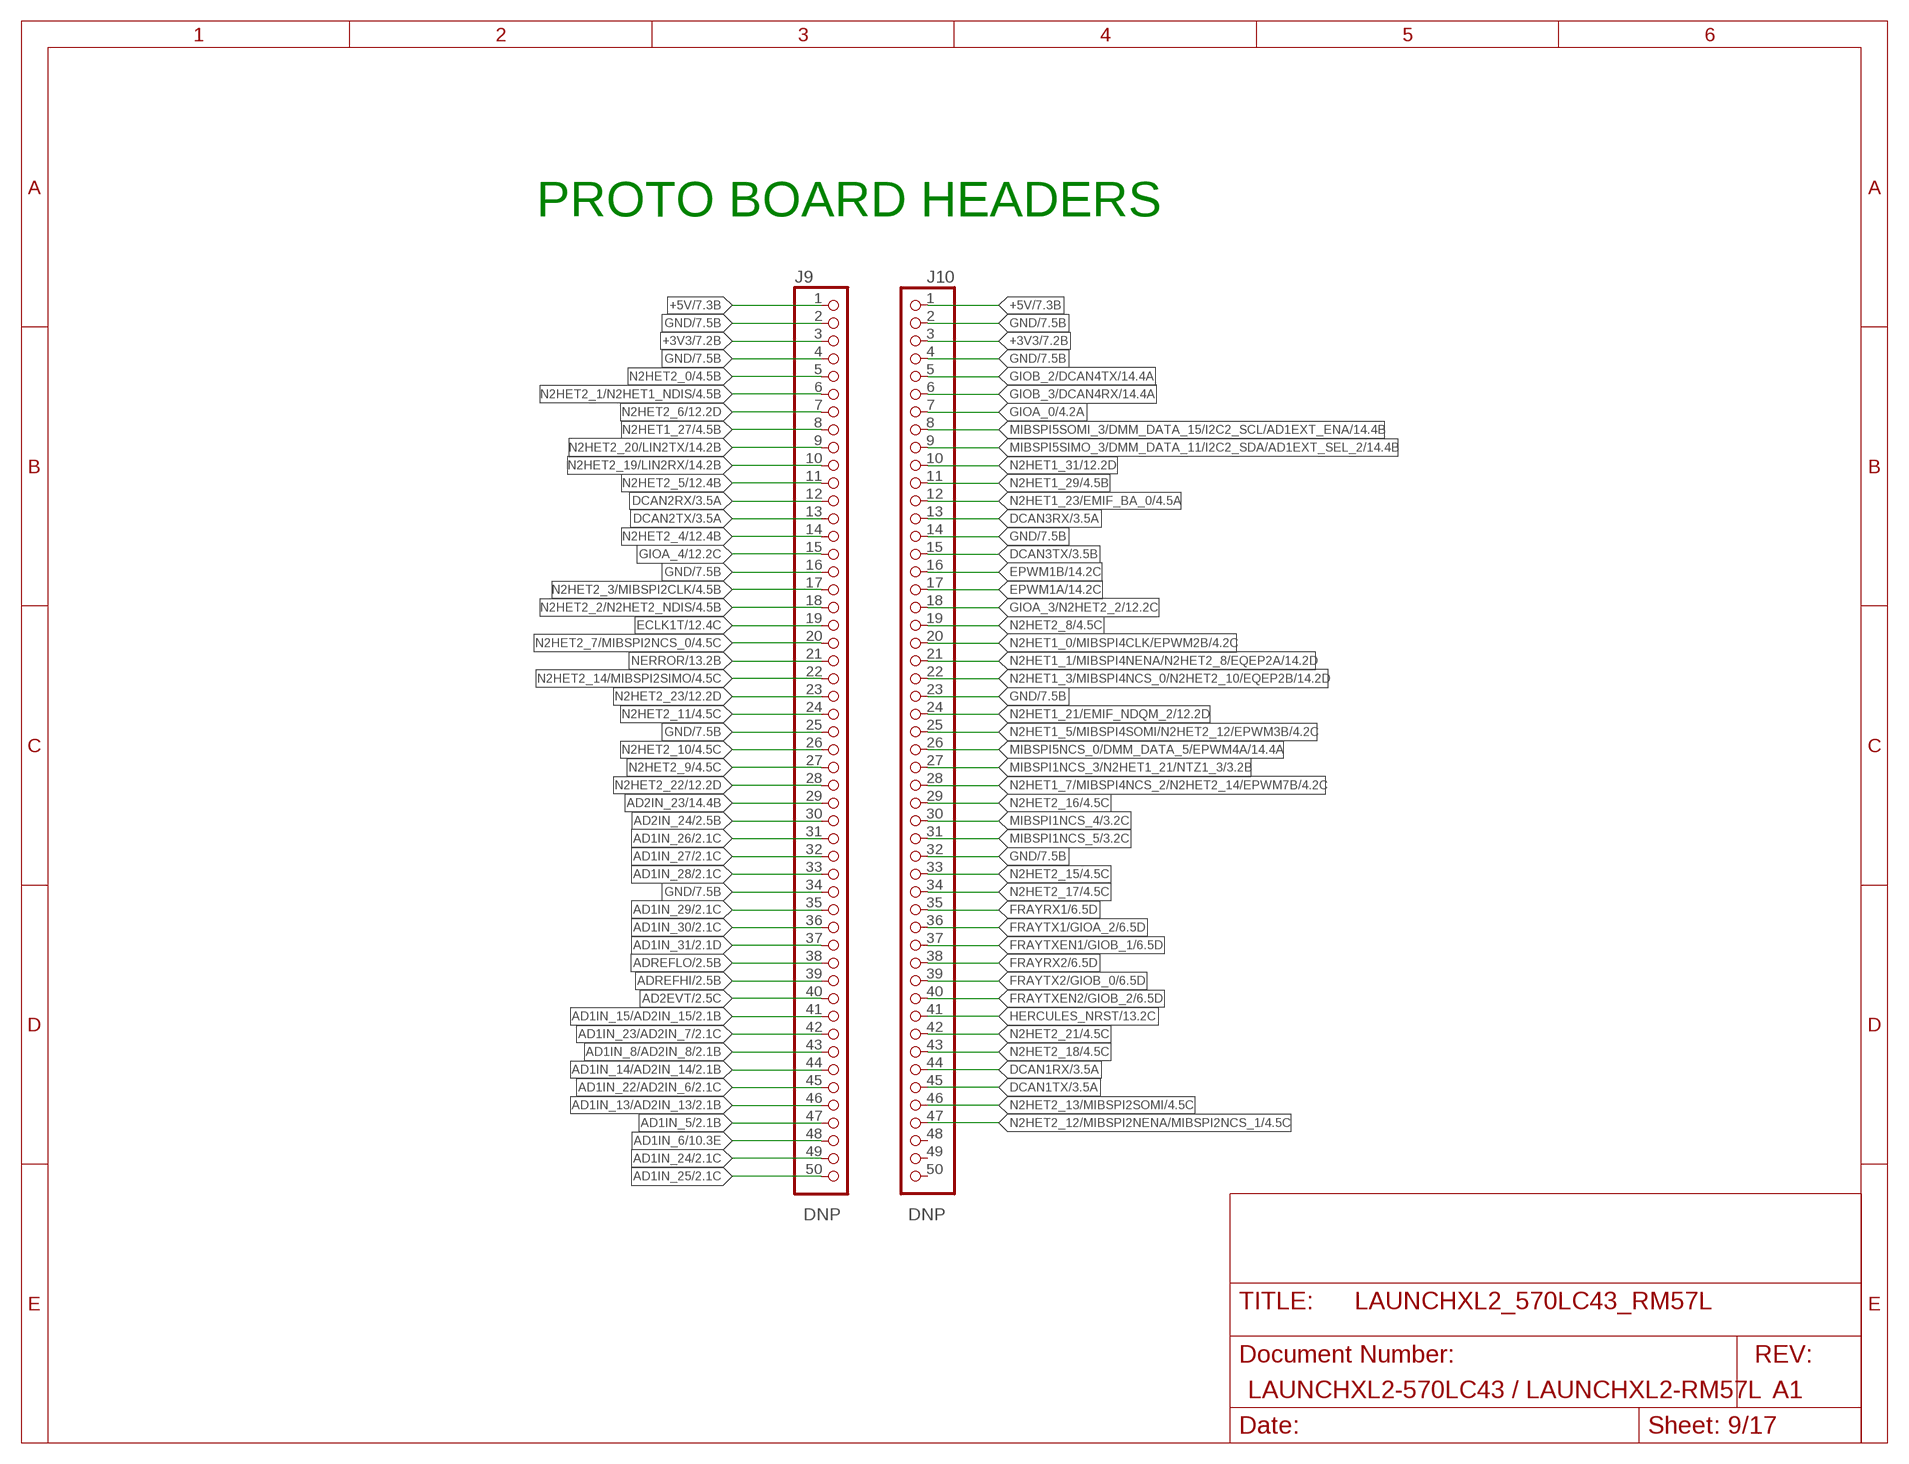
[diagram p8: schematic, sheet 9]

### Parts
J9  PINHD-1X50ALT  [1X50_ALT]
J10  PINHD-1X50  [1X50]

### Nets
+3V3 [pwr]: J9.3 J10.3 ; also sheet 2,3,5,6,7,8,10,11,12,13,14,15,16
+5V [pwr]: J9.1 J10.1 ; also sheet 2,7,8,11,17
AD1IN_5: J9.47 ; also sheet 2
AD1IN_6: J9.48 ; also sheet 2,10
AD1IN_8/AD2IN_8: J9.43 ; also sheet 2
AD1IN_13/AD2IN_13: J9.46 ; also sheet 2
AD1IN_14/AD2IN_14: J9.44 ; also sheet 2
AD1IN_15/AD2IN_15: J9.41 ; also sheet 2
AD1IN_22/AD2IN_6: J9.45 ; also sheet 2
AD1IN_23/AD2IN_7: J9.42 ; also sheet 2
AD1IN_24: J9.49 ; also sheet 2
AD1IN_25: J9.50 ; also sheet 2
AD1IN_26: J9.31 ; also sheet 2
AD1IN_27: J9.32 ; also sheet 2
AD1IN_28: J9.33 ; also sheet 2
AD1IN_29: J9.35 ; also sheet 2
AD1IN_30: J9.36 ; also sheet 2
AD1IN_31: J9.37 ; also sheet 2
AD2EVT: J9.40 ; also sheet 2
AD2IN_23: J9.29 ; also sheet 2,14
AD2IN_24: J9.30 ; also sheet 2
ADREFHI: J9.39 ; also sheet 2
ADREFLO: J9.38 ; also sheet 2
DCAN1RX: J10.44 ; also sheet 3
DCAN1TX: J10.45 ; also sheet 3
DCAN2RX: J9.12 ; also sheet 3
DCAN2TX: J9.13 ; also sheet 3
DCAN3RX: J10.13 ; also sheet 3
DCAN3TX: J10.15 ; also sheet 3
ECLK1T [ETHER]: J9.19 ; also sheet 5,12
EPWM1A: J10.17 ; also sheet 4,14
EPWM1B: J10.16 ; also sheet 4,14
FRAYRX1: J10.35 ; also sheet 6
FRAYRX2: J10.38 ; also sheet 6
FRAYTX1/GIOA_2: J10.36 ; also sheet 6
FRAYTX2/GIOB_0: J10.39 ; also sheet 6
FRAYTXEN1/GIOB_1: J10.37 ; also sheet 6
FRAYTXEN2/GIOB_2: J10.40 ; also sheet 6
GIOA_0: J10.7 ; also sheet 4,7
GIOA_3/N2HET2_2: J10.18 ; also sheet 4,12
GIOA_4: J9.15 ; also sheet 4,12
GIOB_2/DCAN4TX: J10.5 ; also sheet 4,7,14
GIOB_3/DCAN4RX: J10.6 ; also sheet 4,7,14
GND [pwr]: J9.2 J9.4 J9.16 J9.25 J9.34 J10.2 J10.4 J10.14 J10.23 J10.32 ; also sheet 2,3,5,6,7,8,10,11,12,13,14,15,16,17
HERCULES_NRST: J10.41 ; also sheet 5,7,8,13,15
MIBSPI1NCS_3/N2HET1_21/NTZ1_3: J10.27 ; also sheet 3
MIBSPI1NCS_4: J10.30 ; also sheet 3
MIBSPI1NCS_5: J10.31 ; also sheet 3
MIBSPI5NCS_0/DMM_DATA_5/EPWM4A: J10.26 ; also sheet 3,14
MIBSPI5SIMO_3/DMM_DATA_11/I2C2_SDA/AD1EXT_SEL_2: J10.9 ; also sheet 3,14
MIBSPI5SOMI_3/DMM_DATA_15/I2C2_SCL/AD1EXT_ENA: J10.8 ; also sheet 3,14
N2HET1_0/MIBSPI4CLK/EPWM2B: J10.20 ; also sheet 4
N2HET1_1/MIBSPI4NENA/N2HET2_8/EQEP2A: J10.21 ; also sheet 4,8,14
N2HET1_3/MIBSPI4NCS_0/N2HET2_10/EQEP2B: J10.22 ; also sheet 4,14
N2HET1_5/MIBSPI4SOMI/N2HET2_12/EPWM3B: J10.25 ; also sheet 4
N2HET1_7/MIBSPI4NCS_2/N2HET2_14/EPWM7B: J10.28 ; also sheet 4
N2HET1_21/EMIF_NDQM_2: J10.24 ; also sheet 4,12
N2HET1_23/EMIF_BA_0: J10.12 ; also sheet 4
N2HET1_27: J9.8 ; also sheet 4
N2HET1_29: J10.11 ; also sheet 4
N2HET1_31: J10.10 ; also sheet 4,12
N2HET2_0: J9.5 ; also sheet 4
N2HET2_1/N2HET1_NDIS: J9.6 ; also sheet 4
N2HET2_2/N2HET2_NDIS: J9.18 ; also sheet 4
N2HET2_3/MIBSPI2CLK: J9.17 ; also sheet 4
N2HET2_4: J9.14 ; also sheet 4,12
N2HET2_5: J9.11 ; also sheet 4,12
N2HET2_6: J9.7 ; also sheet 4,12
N2HET2_7/MIBSPI2NCS_0: J9.20 ; also sheet 4
N2HET2_8: J10.19 ; also sheet 4
N2HET2_9: J9.27 ; also sheet 4
N2HET2_10: J9.26 ; also sheet 4
N2HET2_11: J9.24 ; also sheet 4
N2HET2_12/MIBSPI2NENA/MIBSPI2NCS_1: J10.47 ; also sheet 4
N2HET2_13/MIBSPI2SOMI: J10.46 ; also sheet 4
N2HET2_14/MIBSPI2SIMO: J9.22 ; also sheet 4
N2HET2_15: J10.33 ; also sheet 4
N2HET2_16: J10.29 ; also sheet 4
N2HET2_17: J10.34 ; also sheet 4
N2HET2_18: J10.43 ; also sheet 4
N2HET2_19/LIN2RX: J9.10 ; also sheet 3,14
N2HET2_20/LIN2TX: J9.9 ; also sheet 3,14
N2HET2_21: J10.42 ; also sheet 4
N2HET2_22: J9.28 ; also sheet 4,12
N2HET2_23: J9.23 ; also sheet 4,12
NERROR: J9.21 ; also sheet 5,13
Unconnected: J10.48 J10.49 J10.50

### Notes on the sheet
- PROTO BOARD HEADERS

## Sheet 10 of 17
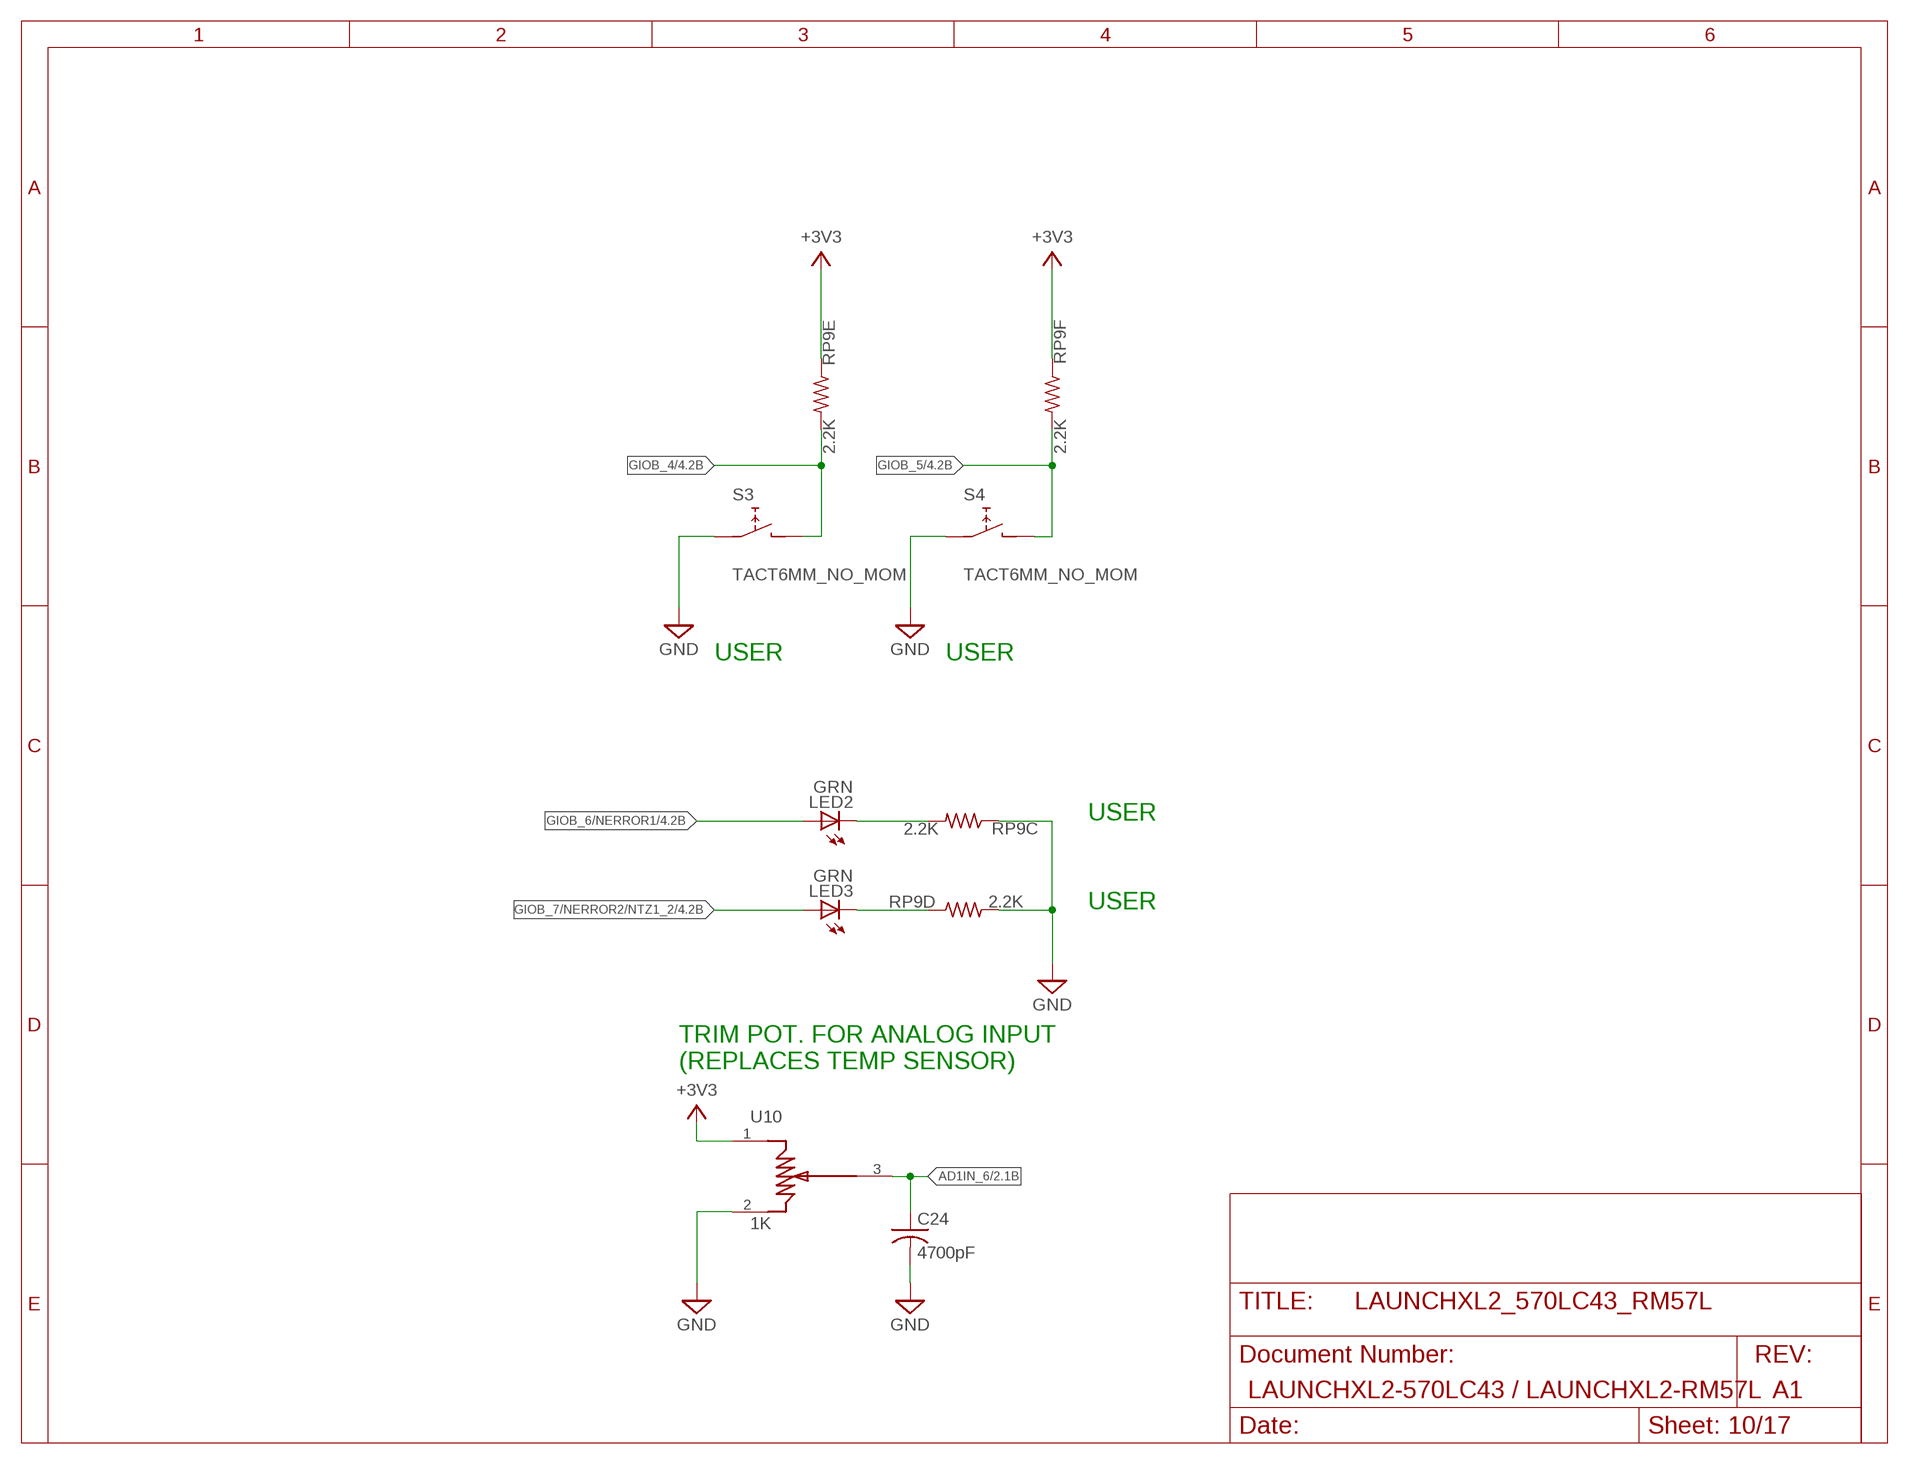
[diagram p9: schematic, sheet 10]

### Parts
C24  4700pF  C-USC0201  [C0201]
LED2  GRN  LEDCHIPLED_0603  [CHIPLED_0603]
LED3  GRN  LEDCHIPLED_0603  [CHIPLED_0603]
S3  TACT6MM_NO_MOM  [CK_PTS645_SMD]
S4  TACT6MM_NO_MOM  [CK_PTS645_SMD]
U10  1K  TRIMPOTHACK_FIT_ON_SOT23  [SOT23]

### Nets
+3V3 [pwr]: RP9.9 RP9.11 U10.1 ; also sheet 2,3,5,6,7,8,9,11,12,13,14,15,16
AD1IN_6: C24.1 U10.3 ; also sheet 2,9
GIOB_4: RP9.10 S3.3 S3.4 ; also sheet 4
GIOB_5: RP9.12 S4.3 S4.4 ; also sheet 4
GIOB_6/NERROR1: LED2.A ; also sheet 4
GIOB_7/NERROR2/NTZ1_2: LED3.A ; also sheet 4
GND [pwr]: C24.2 RP9.5 RP9.8 S3.1 S3.2 S4.1 S4.2 U10.2 ; also sheet 2,3,5,6,7,8,9,11,12,13,14,15,16,17
RP9C: LED2.C RP9.6
RP9D: LED3.C RP9.7

### Notes on the sheet
- USER | USER
- USER
- USER
- TRIM POT. FOR ANALOG INPUT
  (REPLACES TEMP SENSOR)

## Sheet 11 of 17
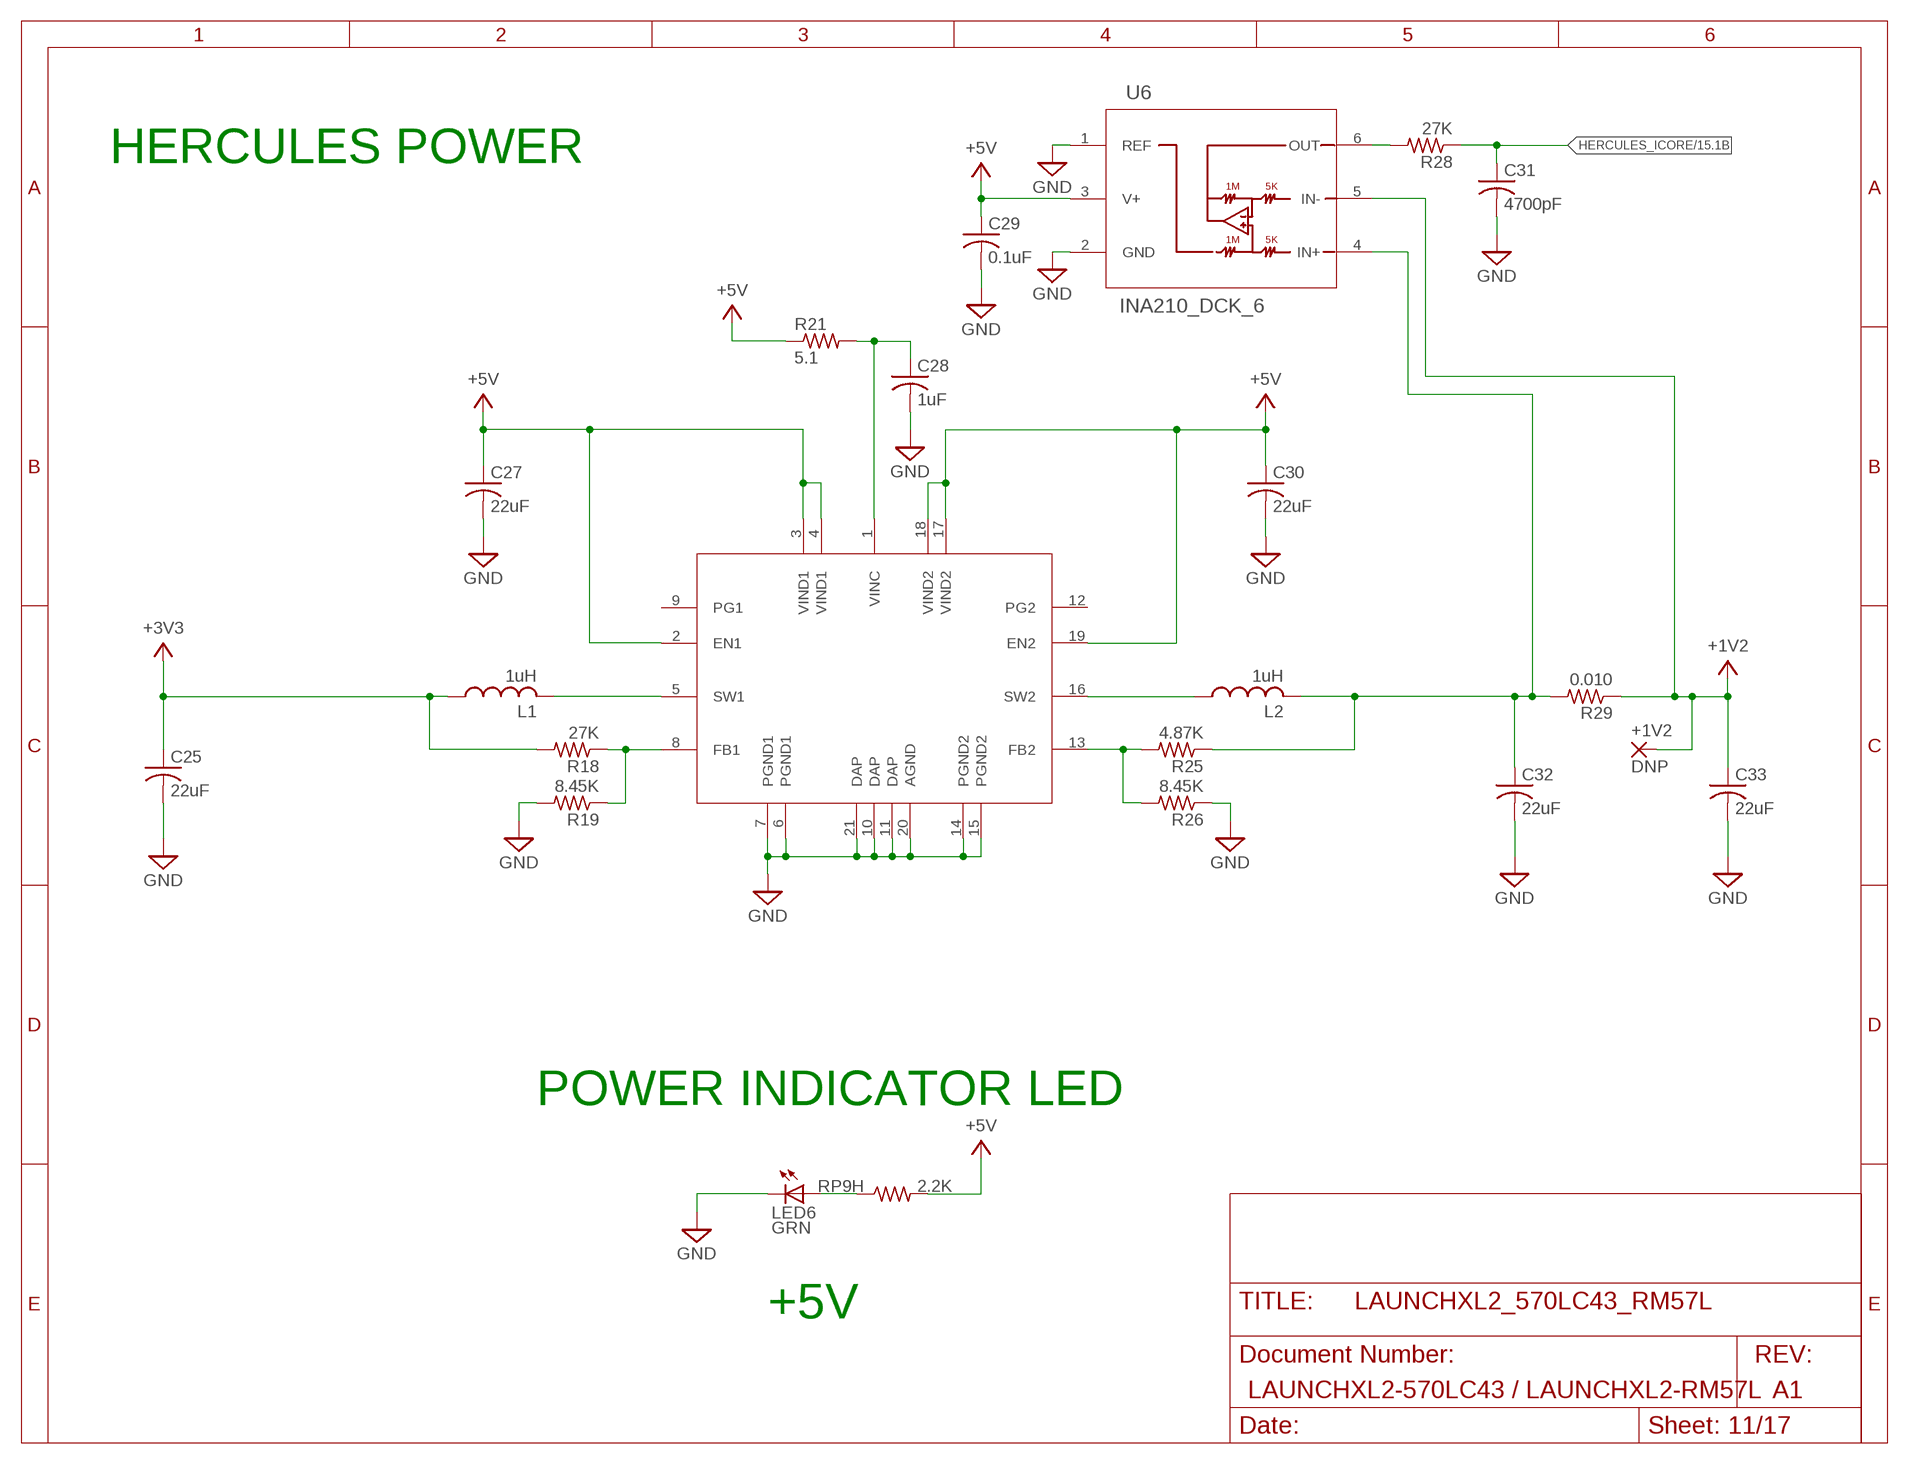
[diagram p10: schematic, sheet 11]

### Parts
+1V2  DNP  WIREPAD1,6/0,9  [1,6/0,9]
C25  22uF  C-USC0805K  [C0805K]
C27  22uF  C-USC0805K  [C0805K]
C28  1uF  C-USC0402K  [C0402K]
C29  0.1uF  C-USC0201  [C0201]
C30  22uF  C-USC0805K  [C0805K]
C31  4700pF  C-USC0201  [C0201]
C32  22uF  C-USC0805K  [C0805K]
C33  22uF  C-USC0805K  [C0805K]
L1  1uH  L-USL2520P  [L2520P]
L2  1uH  L-USL2520P  [L2520P]
LED6  GRN  LEDCHIPLED_0603  [CHIPLED_0603]
R18  27K  R-US_R0201  [R0201]
R19  8.45K  R-US_R0201  [R0201]
R21  5.1  R-US_R0201  [R0201]
R25  4.87K  R-US_R0201  [R0201]
R26  8.45K  R-US_R0201  [R0201]
R28  27K  R-US_R0201  [R0201]
R29  0.010  R-US_R0603  [R0603]
U5  LM26420XMHX/NOPB  LM26420_PWP_20  [MXA20A]
U6  INA210_DCK_6  [DCK6]

### Nets
+1V2 [pwr]: +1V2.1(P) C33.1 R29.1 U6.5(IN-) ; also sheet 5,6,15
+3V3 [pwr]: C25.1 L1.1 R18.2 ; also sheet 2,3,5,6,7,8,9,10,12,13,14,15,16
+5V [pwr]: C27.1 C29.1 C30.1 R21.1 RP9.16 U5.2(EN1) U5.3(VIND1) U5.4(VIND1) U5.17(VIND2) U5.18(VIND2) U5.19(EN2) U6.3(V+) ; also sheet 2,7,8,9,17
GND [pwr]: C25.2 C27.2 C28.2 C29.2 C30.2 C31.2 C32.2 C33.2 LED6.C R19.2 R26.1 U5.6(PGND1) U5.7(PGND1) U5.10(DAP) U5.11(DAP) U5.14(PGND2) U5.15(PGND2) U5.20(AGND) U5.21(DAP) U6.1(REF) U6.2(GND) ; also sheet 2,3,5,6,7,8,9,10,12,13,14,15,16,17
HERCULES_ICORE: C31.1 R28.1 ; also sheet 15
N$9: L1.2 U5.5(SW1)
N$11: R18.1 R19.1 U5.8(FB1)
N$12: L2.1 U5.16(SW2)
N$13: C28.1 R21.2 U5.1(VINC)
N$17: R25.2 R26.2 U5.13(FB2)
N$22: C32.1 L2.2 R25.1 R29.2 U6.4(IN+)
N$41: R28.2 U6.6(OUT)
RP12E: LED6.A RP9.15
Unconnected: U5.9(PG1) U5.12(PG2)

### Notes on the sheet
- HERCULES POWER
- POWER INDICATOR LED
- +5V

## Sheet 12 of 17
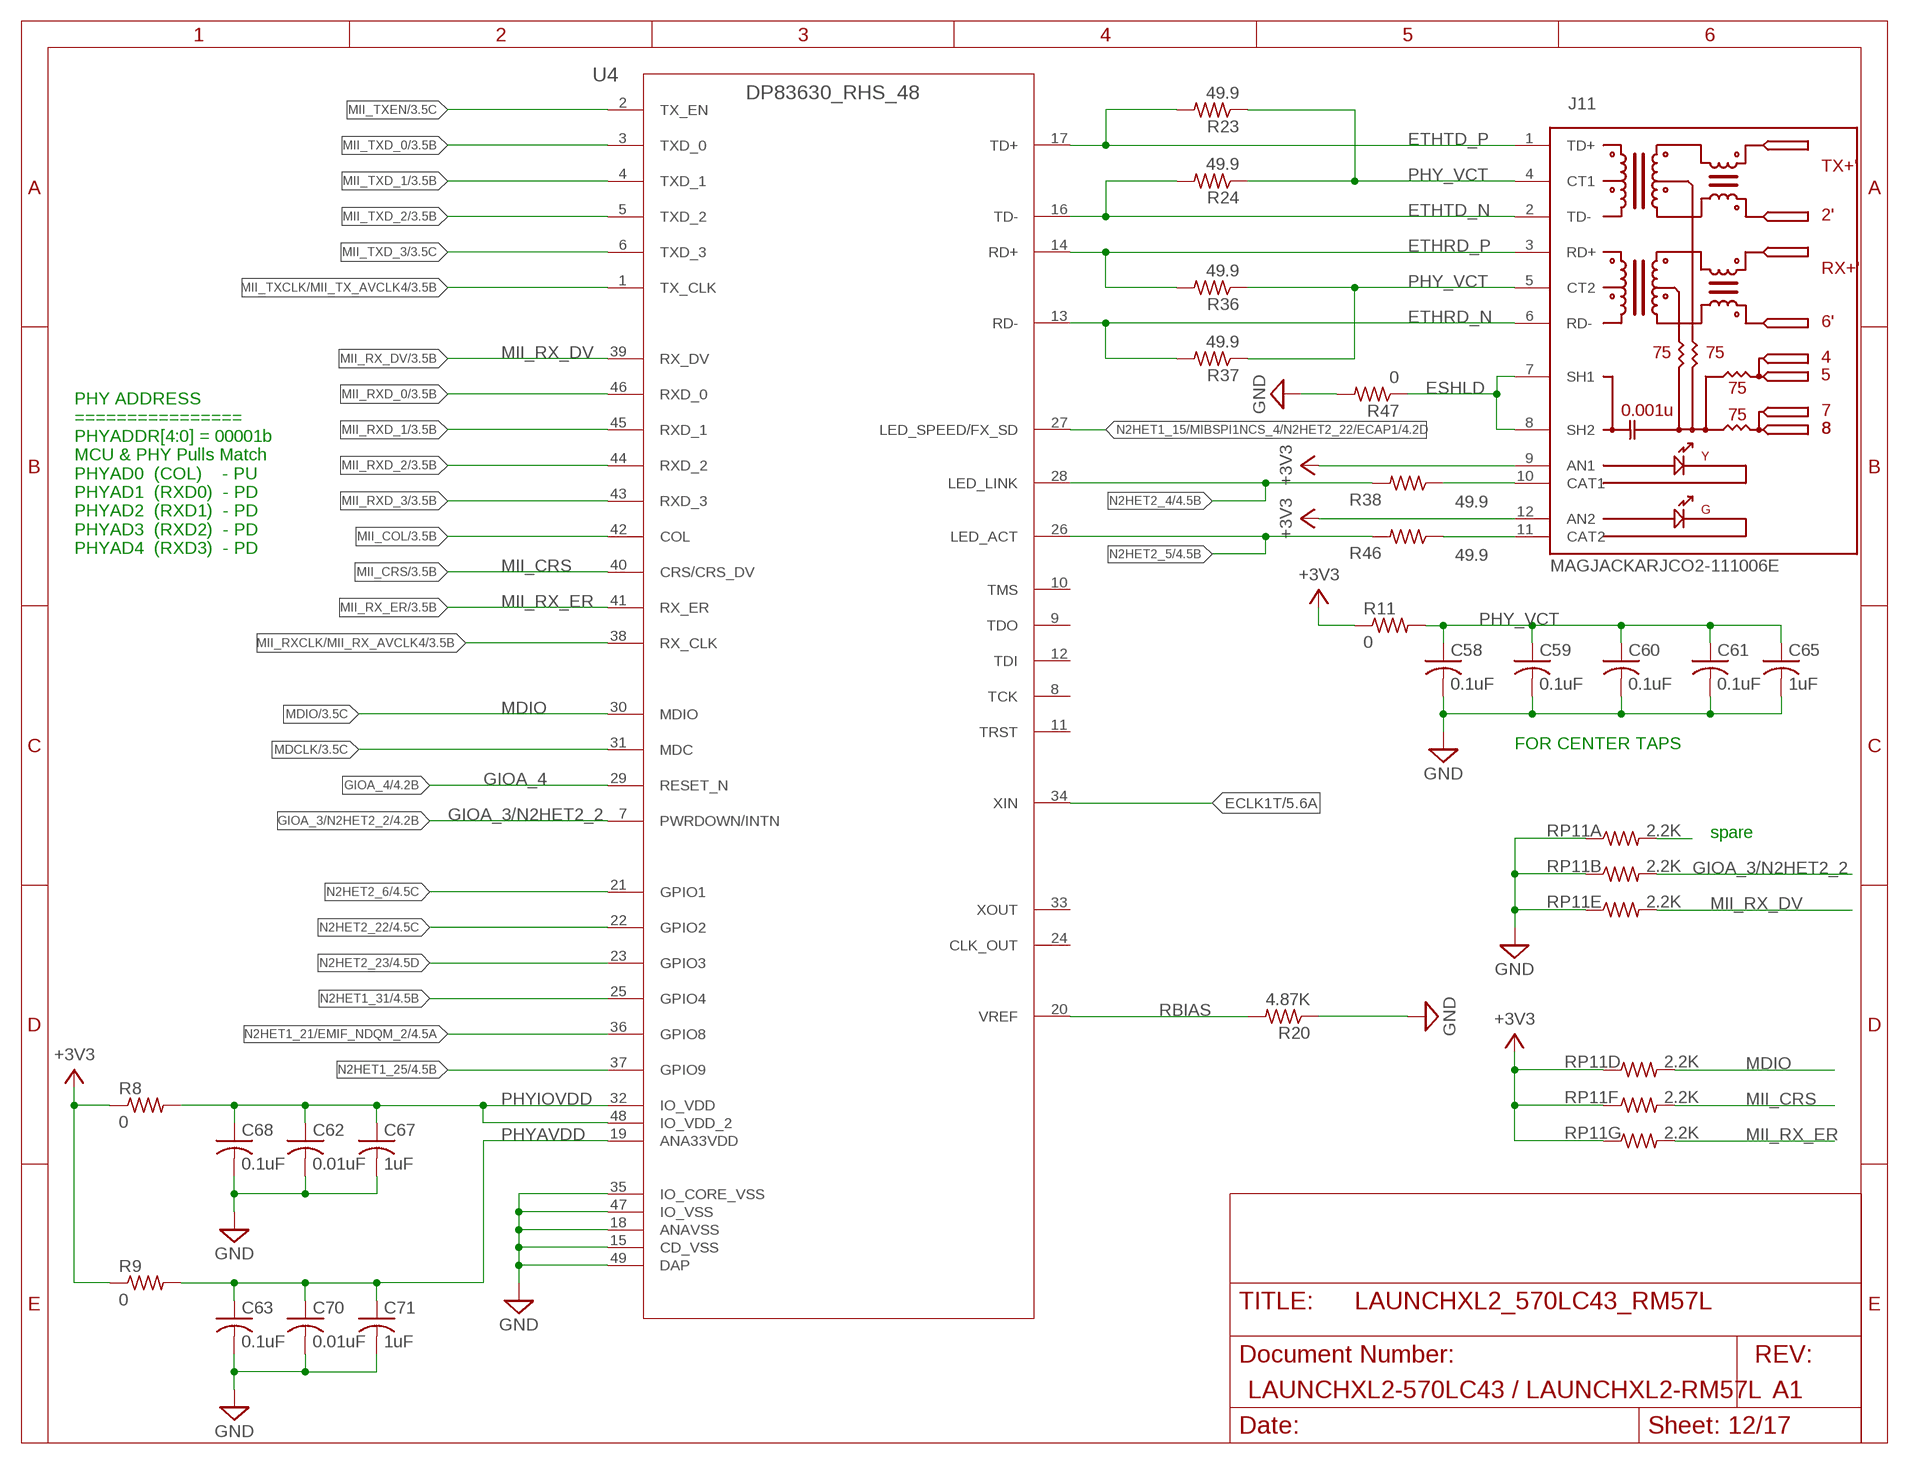
[diagram p11: schematic, sheet 12]

### Parts
C58  0.1uF  C-USC0201  [C0201]
C59  0.1uF  C-USC0201  [C0201]
C60  0.1uF  C-USC0201  [C0201]
C61  0.1uF  C-USC0201  [C0201]
C62  0.01uF  C-USC0201  [C0201]
C63  0.1uF  C-USC0201  [C0201]
C65  1uF  C-USC0402K  [C0402K]
C67  1uF  C-USC0402K  [C0402K]
C68  0.1uF  C-USC0201  [C0201]
C70  0.01uF  C-USC0201  [C0201]
C71  1uF  C-USC0402K  [C0402K]
J11  MAGJACKARJCO2-111006E  [DUAL_ABRACRON_ARJC02_111006K_PULSE_J00-0065NL]
R8  0  R-US_R0201  [R0201]
R9  0  R-US_R0201  [R0201]
R11  0  R-US_R0201  [R0201]
R20  4.87K  R-US_R0201  [R0201]
R23  49.9  R-US_R0201  [R0201]
R24  49.9  R-US_R0201  [R0201]
R36  49.9  R-US_R0201  [R0201]
R37  49.9  R-US_R0201  [R0201]
R38  49.9  R-US_R0201  [R0201]
R46  49.9  R-US_R0201  [R0201]
R47  0  R-US_R0201  [R0201]
RP11  2.2K  R-ARRAY-8_  [RP8_1506_1606]
U4  DP83630_RHS_48  [SQA48A]

### Nets
+3V3 [pwr]: J11.9(AN1) J11.12(AN2) R8.1 R9.1 R11.1 RP11.7 RP11.11 RP11.13 ; also sheet 2,3,5,6,7,8,9,10,11,13,14,15,16
ECLK1T [ETHER]: U4.34(XIN) ; also sheet 5,9
ESHLD: J11.7(SH1) J11.8(SH2) R47.1
ETHRD_N [ETHRD]: J11.6(RD-) R37.2 U4.13(RD-)
ETHRD_P [ETHRD]: J11.3(RD+) R36.2 U4.14(RD+)
ETHTD_N [ETHTD]: J11.2(TD-) R24.2 U4.16(TD-)
ETHTD_P [ETHTD]: J11.1(TD+) R23.2 U4.17(TD+)
GIOA_3/N2HET2_2: RP11.4 U4.7(PWRDOWN/INTN) ; also sheet 4,9
GIOA_4: U4.29(RESET_N) ; also sheet 4,9
GND [pwr]: C58.2 C59.2 C60.2 C61.2 C62.2 C63.2 C65.2 C67.2 C68.2 C70.2 C71.2 R20.1 R47.2 RP11.1 RP11.3 RP11.9 U4.15(CD_VSS) U4.18(ANAVSS) U4.35(IO_CORE_VSS) U4.47(IO_VSS) U4.49(DAP) ; also sheet 2,3,5,6,7,8,9,10,11,13,14,15,16,17
MDCLK: U4.31(MDC) ; also sheet 3
MDIO: RP11.8 U4.30(MDIO) ; also sheet 3
MII_COL [ETHER]: U4.42(COL) ; also sheet 3
MII_CRS [ETHER]: RP11.12 U4.40(CRS/CRS_DV) ; also sheet 3
MII_RX_DV [ETHER]: RP11.10 U4.39(RX_DV) ; also sheet 3
MII_RX_ER [ETHER]: RP11.14 U4.41(RX_ER) ; also sheet 3
MII_RXCLK/MII_RX_AVCLK4 [ETHER]: U4.38(RX_CLK) ; also sheet 3
MII_RXD_0 [ETHER]: U4.46(RXD_0) ; also sheet 3
MII_RXD_1 [ETHER]: U4.45(RXD_1) ; also sheet 3
MII_RXD_2 [ETHER]: U4.44(RXD_2) ; also sheet 3
MII_RXD_3 [ETHER]: U4.43(RXD_3) ; also sheet 3
MII_TXCLK/MII_TX_AVCLK4 [ETHER]: U4.1(TX_CLK) ; also sheet 3
MII_TXD_0 [ETHER]: U4.3(TXD_0) ; also sheet 3
MII_TXD_1 [ETHER]: U4.4(TXD_1) ; also sheet 3
MII_TXD_2 [ETHER]: U4.5(TXD_2) ; also sheet 3
MII_TXD_3 [ETHER]: U4.6(TXD_3) ; also sheet 3
MII_TXEN [ETHER]: U4.2(TX_EN) ; also sheet 3
N2HET1_15/MIBSPI1NCS_4/N2HET2_22/ECAP1: U4.27(LED_SPEED/FX_SD) ; also sheet 4
N2HET1_21/EMIF_NDQM_2: U4.36(GPIO8) ; also sheet 4,9
N2HET1_25: U4.37(GPIO9) ; also sheet 4
N2HET1_31: U4.25(GPIO4) ; also sheet 4,9
N2HET2_4: R38.2 U4.28(LED_LINK) ; also sheet 4,9
N2HET2_5: R46.2 U4.26(LED_ACT) ; also sheet 4,9
N2HET2_6: U4.21(GPIO1) ; also sheet 4,9
N2HET2_22: U4.22(GPIO2) ; also sheet 4,9
N2HET2_23: U4.23(GPIO3) ; also sheet 4,9
N$10: RP11.2
N$15: J11.10(CAT1) R38.1
N$19: J11.11(CAT2) R46.1
PHY_VCT [pwr]: C58.1 C59.1 C60.1 C61.1 C65.1 J11.4(CT1) J11.5(CT2) R11.2 R23.1 R24.1 R36.1 R37.1
PHYAVDD: C63.1 C70.1 C71.1 R9.2 U4.19(ANA33VDD)
PHYIOVDD: C62.1 C67.1 C68.1 R8.2 U4.32(IO_VDD) U4.48(IO_VDD_2)
RBIAS: R20.2 U4.20(VREF)
Unconnected: RP11.5 RP11.6 RP11.15 RP11.16 U4.8(TCK) U4.9(TDO) U4.10(TMS) U4.11(TRST) U4.12(TDI) U4.24(CLK_OUT) U4.33(XOUT)

### Notes on the sheet
- PHY ADDRESS 
  ================
  PHYADDR[4:0] = 00001b
  MCU & PHY Pulls Match
  PHYAD0  (COL)    - PU
  PHYAD1  (RXD0)  - PD
  PHYAD2  (RXD1)  - PD
  PHYAD3  (RXD2)  - PD
  PHYAD4  (RXD3)  - PD
- FOR CENTER TAPS
- spare

## Sheet 13 of 17
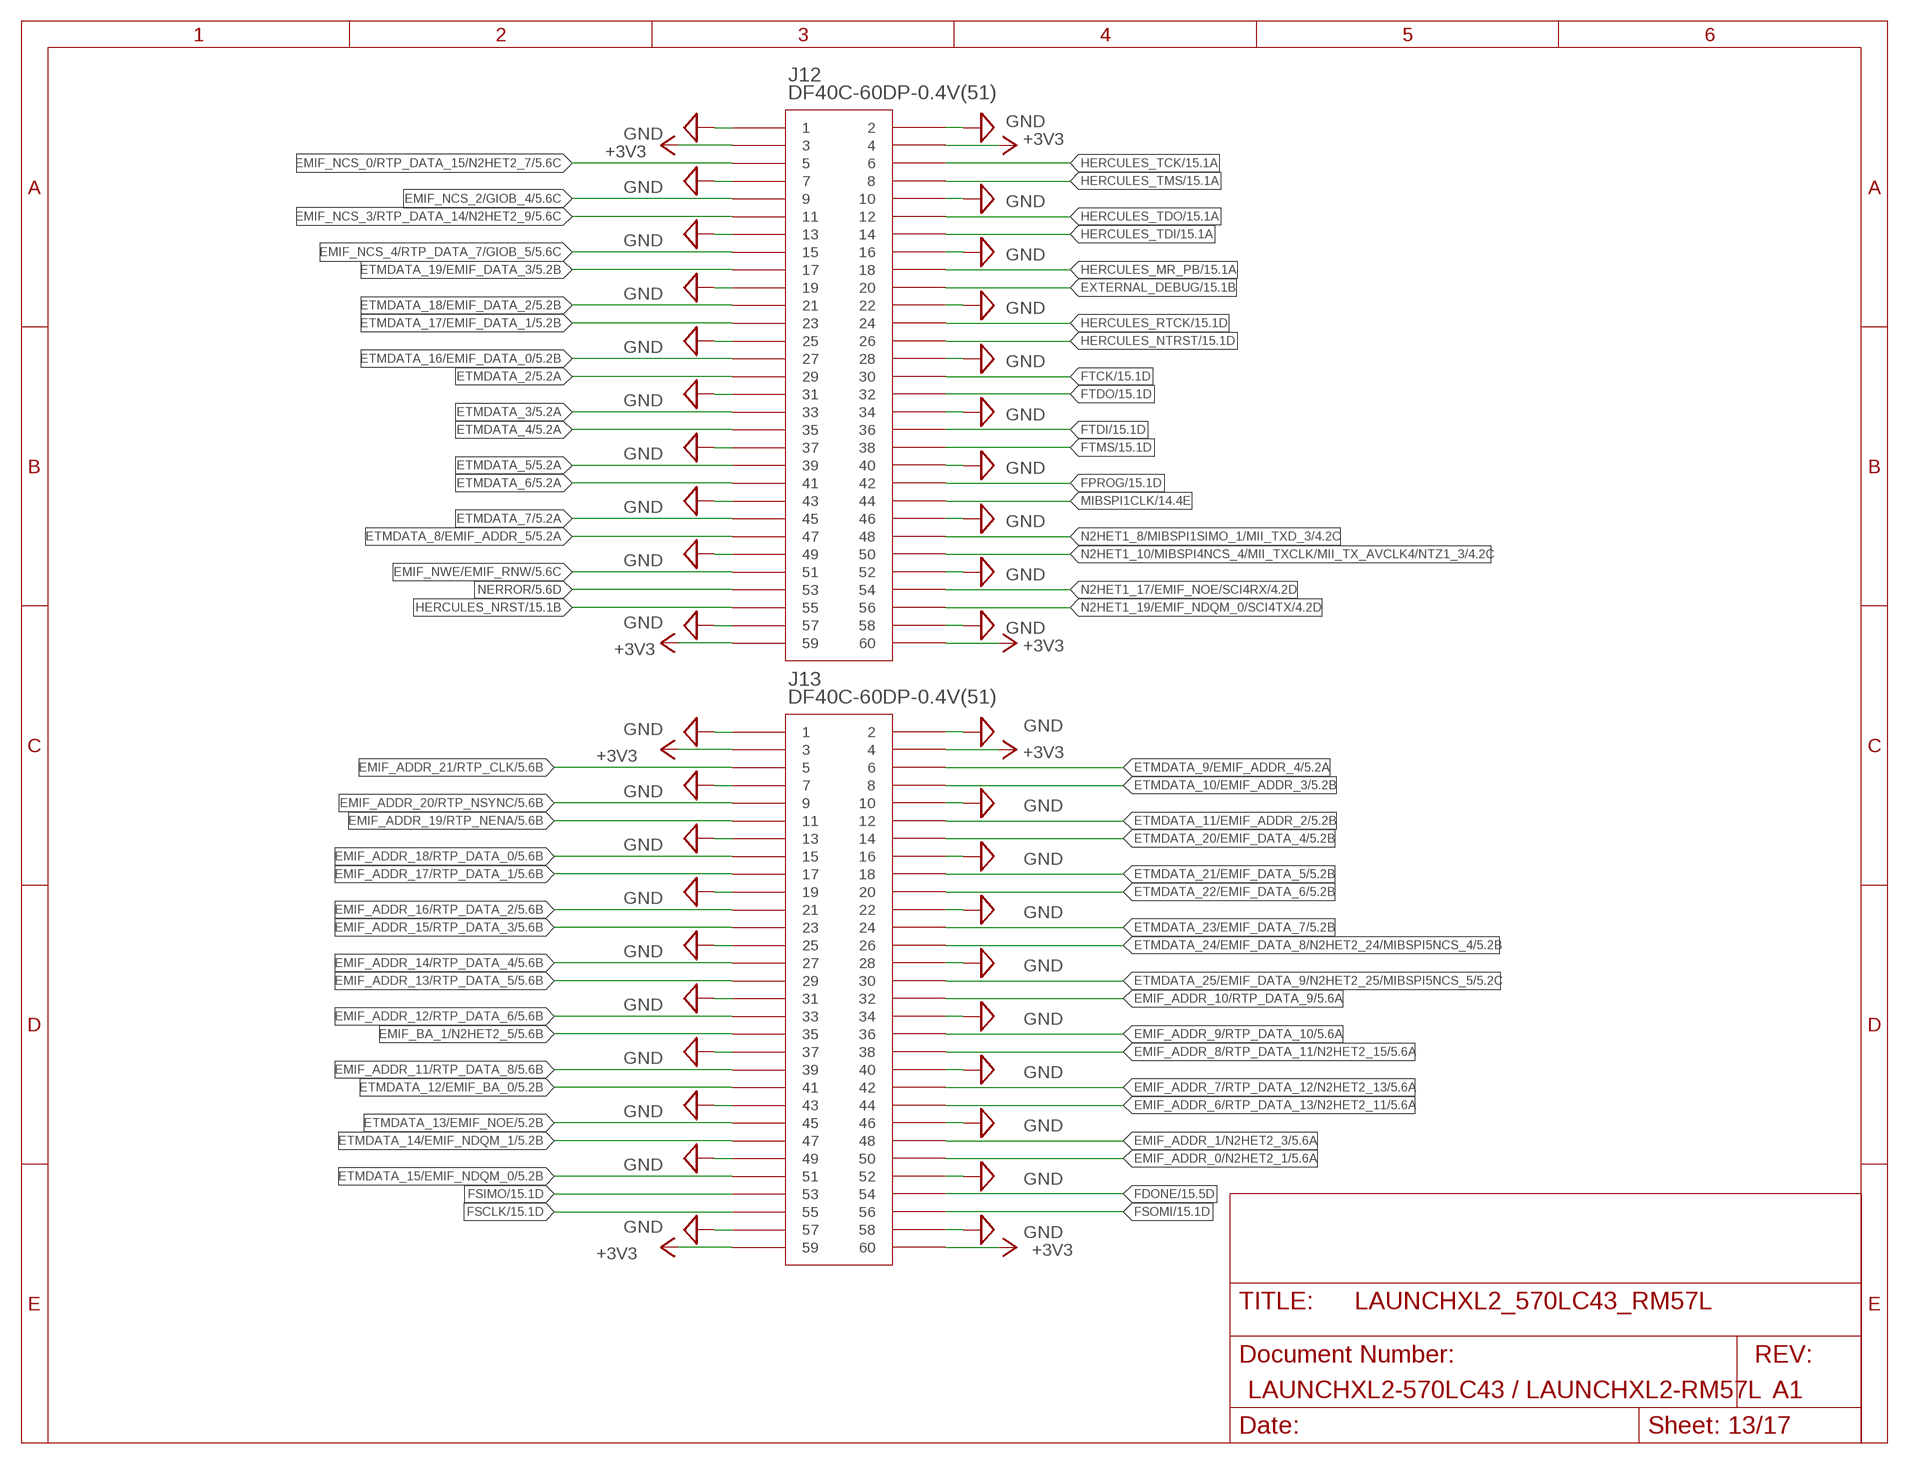
[diagram p12: schematic, sheet 13]

### Parts
J12  DF40C-60DP-0.4V(51)  [DF40C-60DP-0.4V(51)]
J13  DF40C-60DP-0.4V(51)  [DF40C-60DP-0.4V(51)]

### Nets
+3V3 [pwr]: J12.3 J12.4 J12.59 J12.60 J13.3 J13.4 J13.59 J13.60 ; also sheet 2,3,5,6,7,8,9,10,11,12,14,15,16
EMIF_ADDR_0/N2HET2_1 [EMIF]: J13.50 ; also sheet 5
EMIF_ADDR_1/N2HET2_3 [EMIF]: J13.48 ; also sheet 5
EMIF_ADDR_6/RTP_DATA_13/N2HET2_11 [EMIF]: J13.44 ; also sheet 5
EMIF_ADDR_7/RTP_DATA_12/N2HET2_13 [EMIF]: J13.42 ; also sheet 5
EMIF_ADDR_8/RTP_DATA_11/N2HET2_15 [EMIF]: J13.38 ; also sheet 5
EMIF_ADDR_9/RTP_DATA_10 [EMIF]: J13.36 ; also sheet 5
EMIF_ADDR_10/RTP_DATA_9 [EMIF]: J13.32 ; also sheet 5
EMIF_ADDR_11/RTP_DATA_8 [EMIF]: J13.39 ; also sheet 5
EMIF_ADDR_12/RTP_DATA_6 [EMIF]: J13.33 ; also sheet 5
EMIF_ADDR_13/RTP_DATA_5 [EMIF]: J13.29 ; also sheet 5
EMIF_ADDR_14/RTP_DATA_4 [EMIF]: J13.27 ; also sheet 5
EMIF_ADDR_15/RTP_DATA_3 [EMIF]: J13.23 ; also sheet 5
EMIF_ADDR_16/RTP_DATA_2 [EMIF]: J13.21 ; also sheet 5
EMIF_ADDR_17/RTP_DATA_1 [EMIF]: J13.17 ; also sheet 5
EMIF_ADDR_18/RTP_DATA_0 [EMIF]: J13.15 ; also sheet 5
EMIF_ADDR_19/RTP_NENA [EMIF]: J13.11 ; also sheet 5
EMIF_ADDR_20/RTP_NSYNC [EMIF]: J13.9 ; also sheet 5
EMIF_ADDR_21/RTP_CLK [EMIF]: J13.5 ; also sheet 5
EMIF_BA_1/N2HET2_5 [EMIF]: J13.35 ; also sheet 5
EMIF_NCS_0/RTP_DATA_15/N2HET2_7 [EMIF]: J12.5 ; also sheet 5
EMIF_NCS_2/GIOB_4 [EMIF]: J12.9 ; also sheet 5
EMIF_NCS_3/RTP_DATA_14/N2HET2_9 [EMIF]: J12.11 ; also sheet 5
EMIF_NCS_4/RTP_DATA_7/GIOB_5 [EMIF]: J12.15 ; also sheet 5
EMIF_NWE/EMIF_RNW [EMIF]: J12.51 ; also sheet 5
ETMDATA_2: J12.29 ; also sheet 5
ETMDATA_3: J12.33 ; also sheet 5
ETMDATA_4: J12.35 ; also sheet 5
ETMDATA_5: J12.39 ; also sheet 5
ETMDATA_6: J12.41 ; also sheet 5
ETMDATA_7: J12.45 ; also sheet 5
ETMDATA_8/EMIF_ADDR_5: J12.47 ; also sheet 5
ETMDATA_9/EMIF_ADDR_4: J13.6 ; also sheet 5
ETMDATA_10/EMIF_ADDR_3: J13.8 ; also sheet 5
ETMDATA_11/EMIF_ADDR_2: J13.12 ; also sheet 5
ETMDATA_12/EMIF_BA_0: J13.41 ; also sheet 5
ETMDATA_13/EMIF_NOE: J13.45 ; also sheet 5
ETMDATA_14/EMIF_NDQM_1: J13.47 ; also sheet 5
ETMDATA_15/EMIF_NDQM_0: J13.51 ; also sheet 5
ETMDATA_16/EMIF_DATA_0: J12.27 ; also sheet 5
ETMDATA_17/EMIF_DATA_1: J12.23 ; also sheet 5
ETMDATA_18/EMIF_DATA_2: J12.21 ; also sheet 5
ETMDATA_19/EMIF_DATA_3: J12.17 ; also sheet 5
ETMDATA_20/EMIF_DATA_4: J13.14 ; also sheet 5
ETMDATA_21/EMIF_DATA_5: J13.18 ; also sheet 5
ETMDATA_22/EMIF_DATA_6: J13.20 ; also sheet 5
ETMDATA_23/EMIF_DATA_7: J13.24 ; also sheet 5
ETMDATA_24/EMIF_DATA_8/N2HET2_24/MIBSPI5NCS_4: J13.26 ; also sheet 5
ETMDATA_25/EMIF_DATA_9/N2HET2_25/MIBSPI5NCS_5: J13.30 ; also sheet 5
EXTERNAL_DEBUG: J12.20 ; also sheet 3,15
FDONE: J13.54 ; also sheet 15
FPROG: J12.42 ; also sheet 15
FSCLK: J13.55 ; also sheet 15
FSIMO: J13.53 ; also sheet 15
FSOMI: J13.56 ; also sheet 15
FTCK: J12.30 ; also sheet 15
FTDI: J12.36 ; also sheet 15
FTDO: J12.32 ; also sheet 15
FTMS: J12.38 ; also sheet 15
GND [pwr]: J12.1 J12.2 J12.7 J12.10 J12.13 J12.16 J12.19 J12.22 J12.25 J12.28 J12.31 J12.34 J12.37 J12.40 J12.43 J12.46 J12.49 J12.52 J12.57 J12.58 J13.1 J13.2 J13.7 J13.10 J13.13 J13.16 J13.19 J13.22 J13.25 J13.28 J13.31 J13.34 J13.37 J13.40 J13.43 J13.46 J13.49 J13.52 J13.57 J13.58 ; also sheet 2,3,5,6,7,8,9,10,11,12,14,15,16,17
HERCULES_MR_PB: J12.18 ; also sheet 3,5,15
HERCULES_NRST: J12.55 ; also sheet 5,7,8,9,15
HERCULES_NTRST: J12.26 ; also sheet 3,15
HERCULES_RTCK [ETM]: J12.24 ; also sheet 3,15
HERCULES_TCK [ETM]: J12.6 ; also sheet 3,15
HERCULES_TDI: J12.14 ; also sheet 3,15
HERCULES_TDO: J12.12 ; also sheet 3,15
HERCULES_TMS: J12.8 ; also sheet 3,15
MIBSPI1CLK: J12.44 ; also sheet 3,8,14
N2HET1_8/MIBSPI1SIMO_1/MII_TXD_3: J12.48 ; also sheet 4,8
N2HET1_10/MIBSPI4NCS_4/MII_TXCLK/MII_TX_AVCLK4/NTZ1_3: J12.50 ; also sheet 4,8
N2HET1_17/EMIF_NOE/SCI4RX: J12.54 ; also sheet 4
N2HET1_19/EMIF_NDQM_0/SCI4TX: J12.56 ; also sheet 4
NERROR: J12.53 ; also sheet 5,9